# EAGLE schematic u1200 (EAGLE 9.6.2)

## Sheet 1 of 13: TITLE
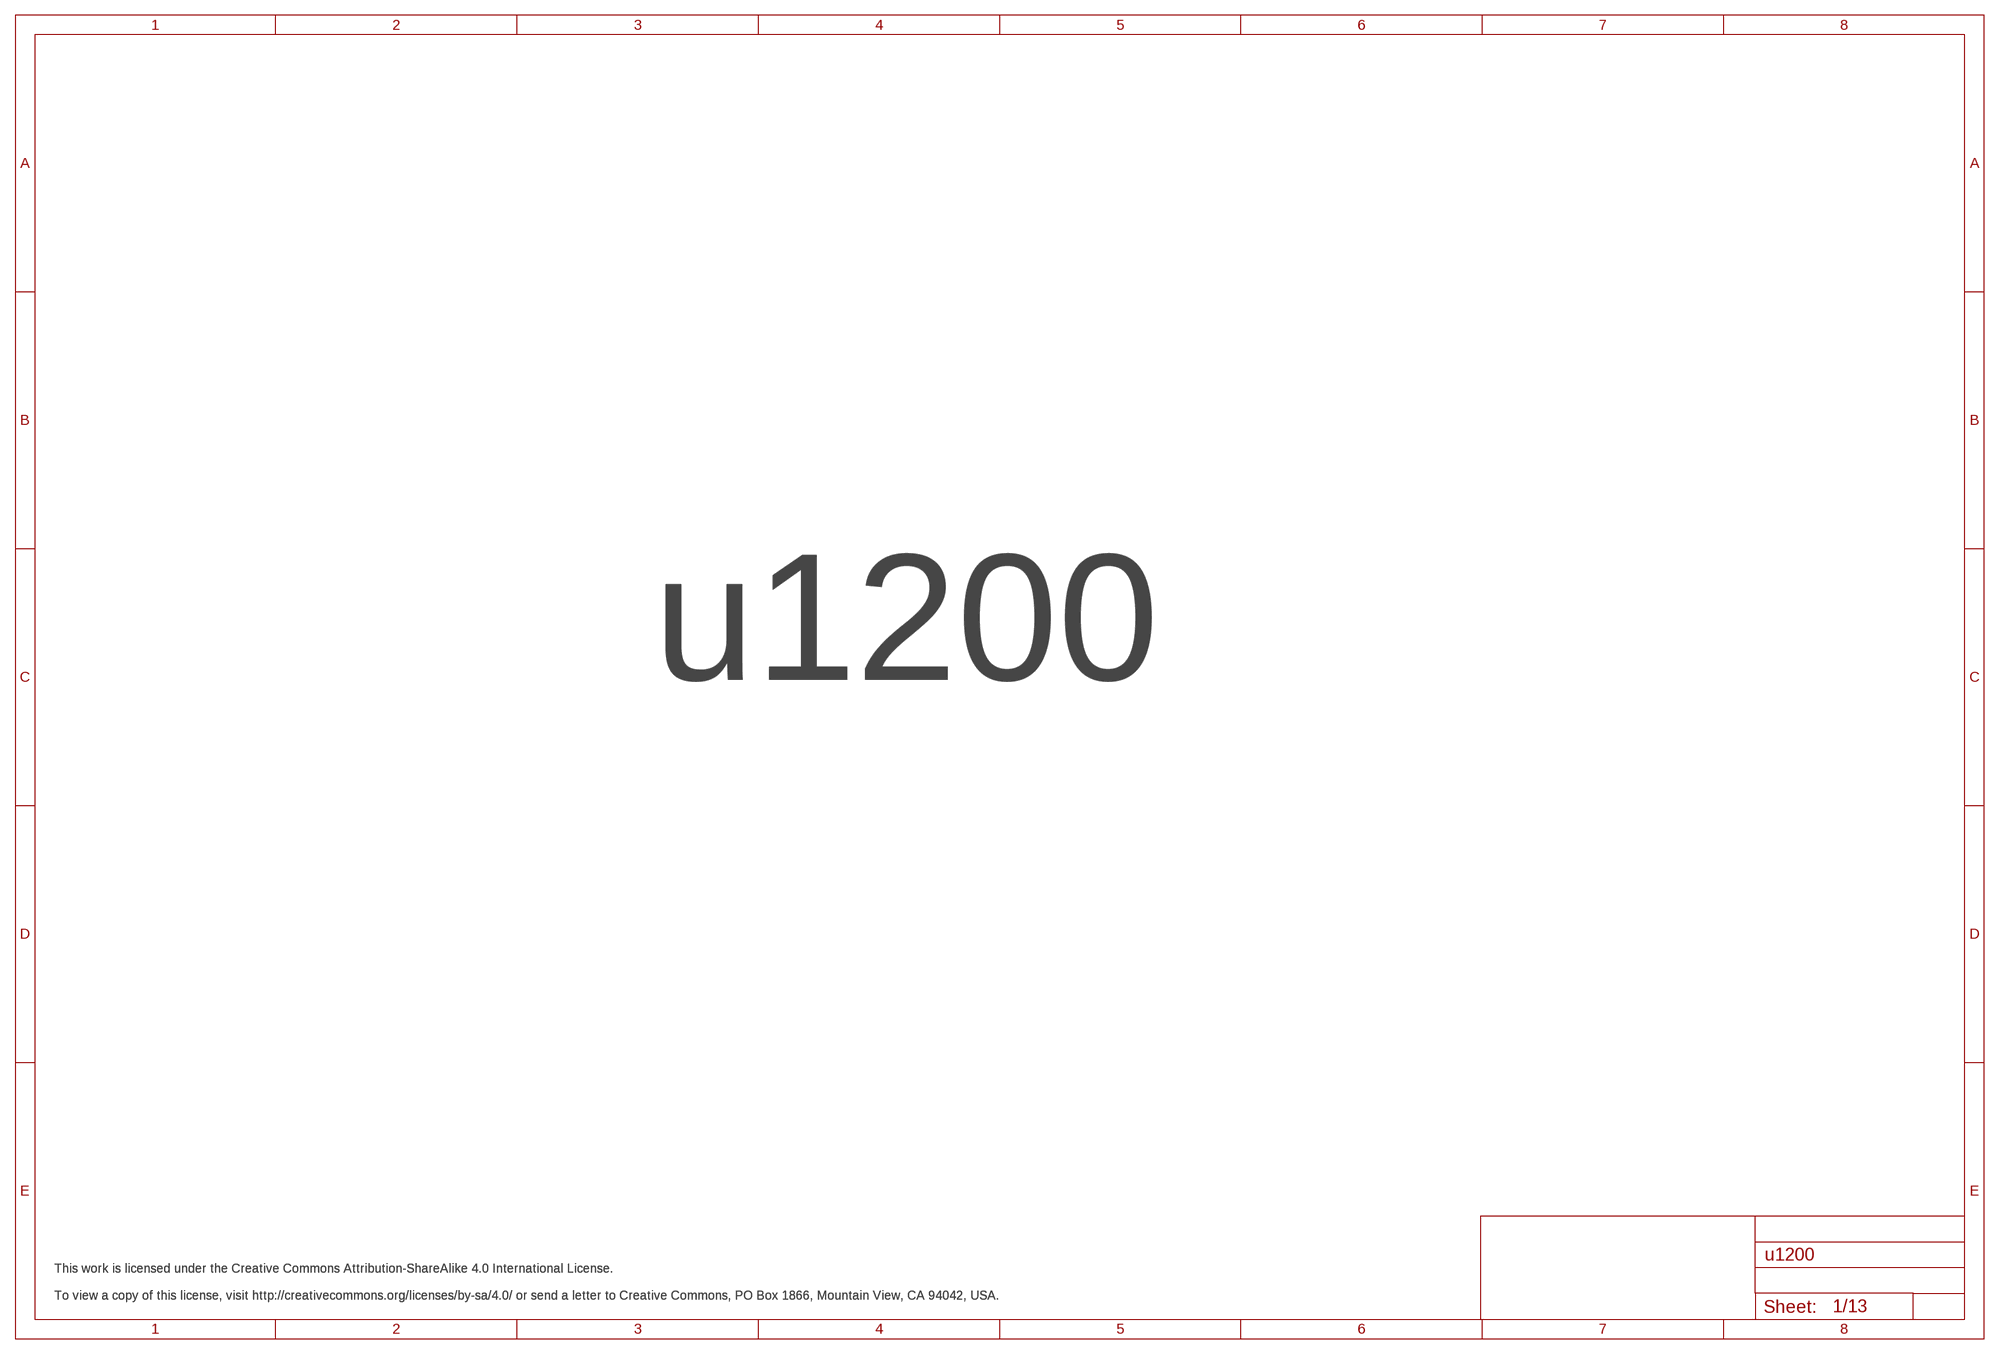
[diagram p0: schematic, sheet 1]

### Notes on the sheet
- u1200
- This work is licensed under the Creative Commons Attribution-ShareAlike 4.0 International License.
  
  To view a copy of this license, visit http://creativecommons.org/licenses/by-sa/4.0/ or send a letter to Creative Commons, PO Box 1866, Mountain View, CA 94042, USA.
- This work is licensed under the Creative Commons Attribution-ShareAlike 4.0 International License.
  
  To view a copy of this license, visit http://creativecommons.org/licenses/by-sa/4.0/ or send a letter to Creative Commons, PO Box 1866, Mountain View, CA 94042, USA.
- This work is licensed under the Creative Commons Attribution-ShareAlike 4.0 International License.
  
  To view a copy of this license, visit http://creativecommons.org/licenses/by-sa/4.0/ or send a letter to Creative Commons, PO Box 1866, Mountain View, CA 94042, USA.

## Sheet 2 of 13: EDGE CONNECTOR
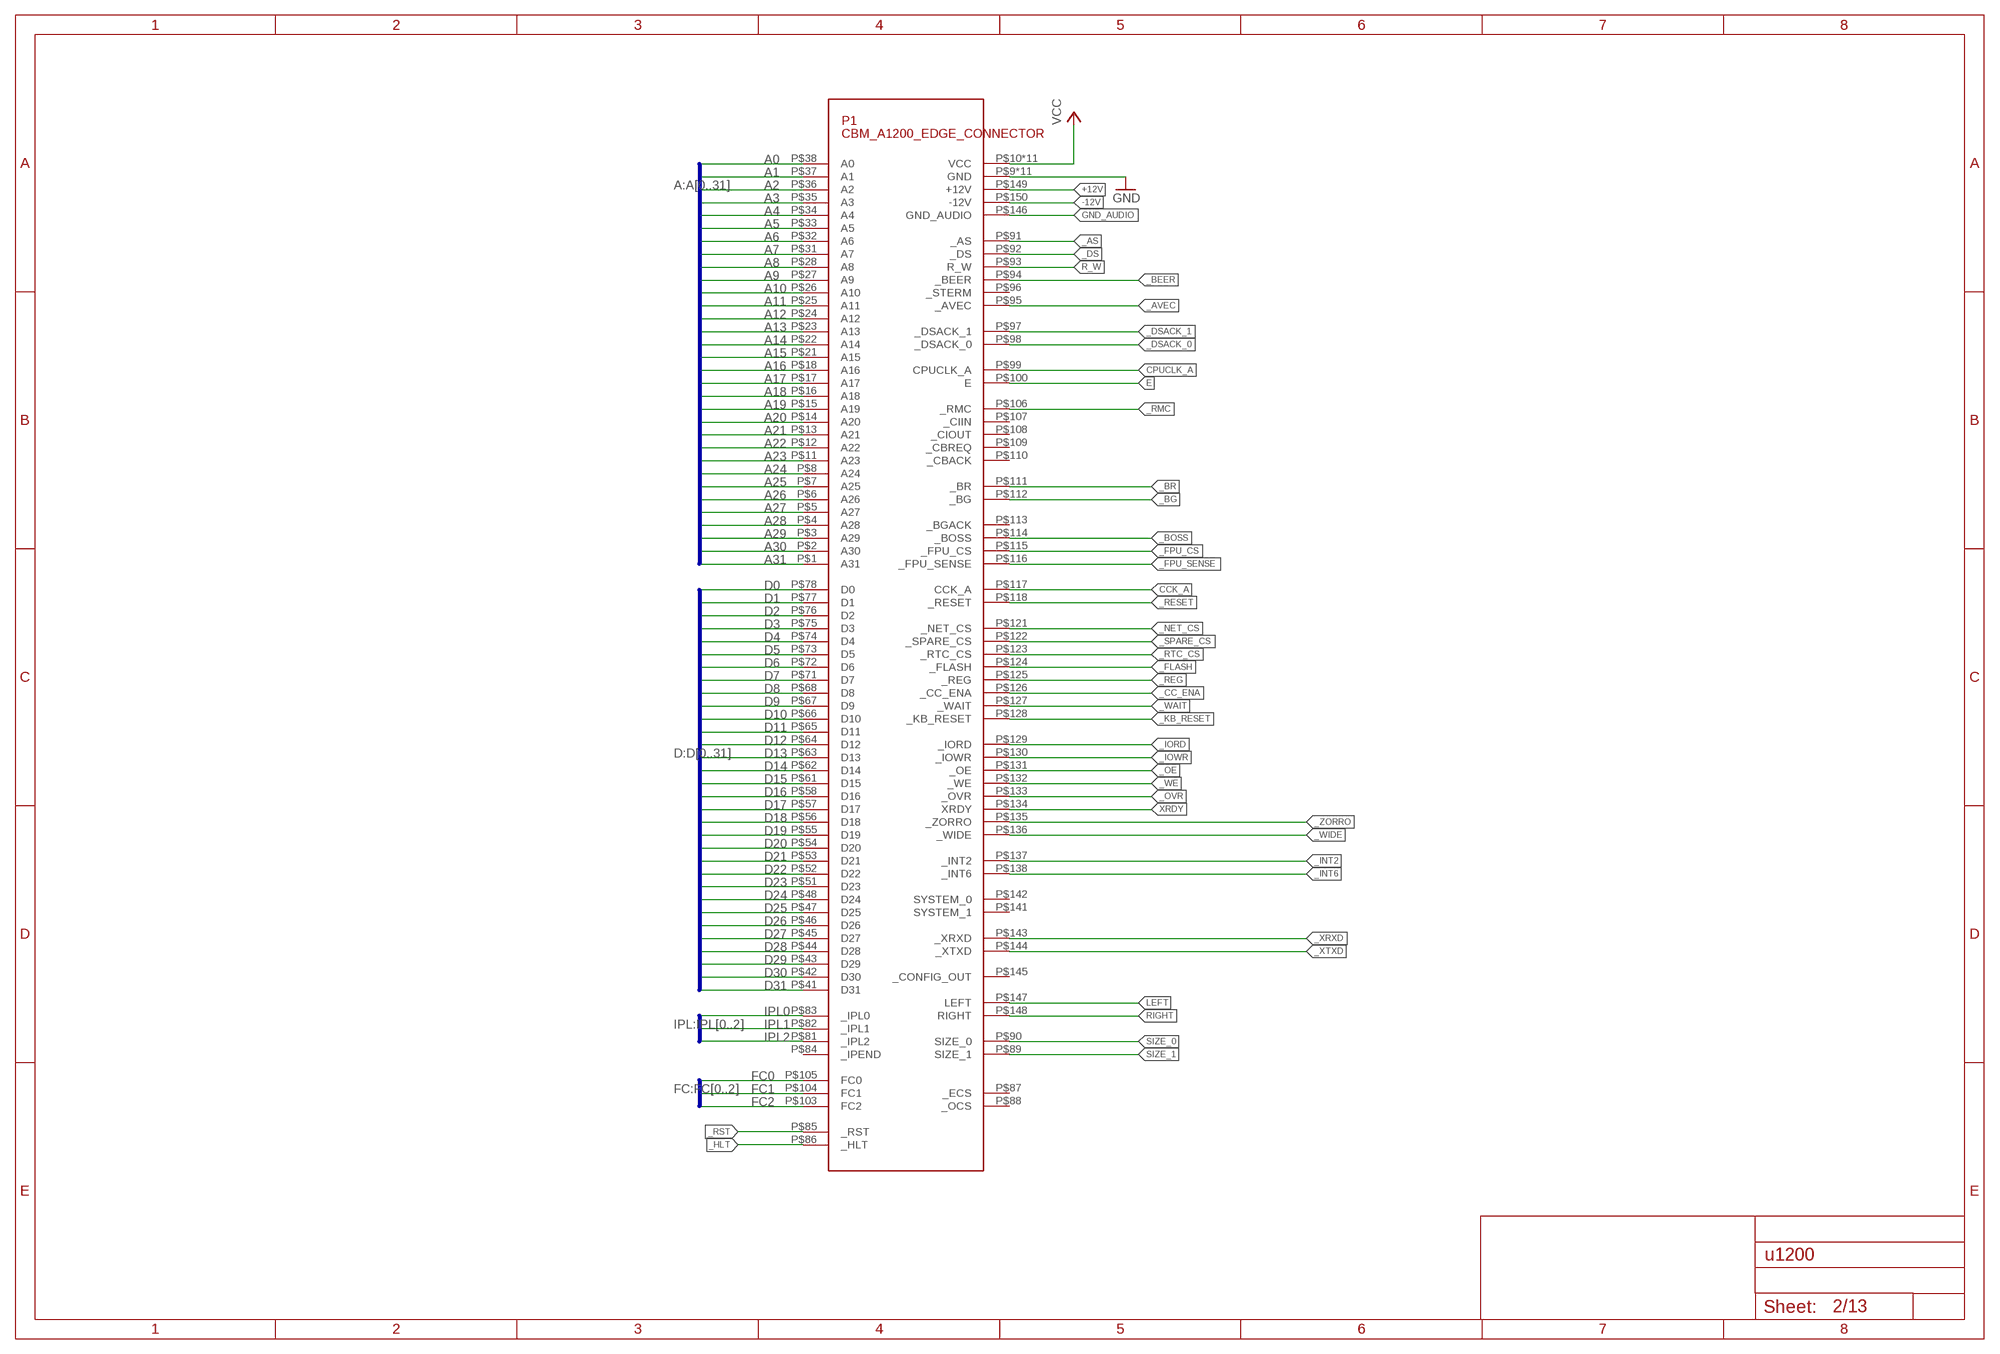
[diagram p1: schematic, sheet 2]

### Parts
P1  CBM_A1200_EDGE_CONNECTOR  [CBM_A1200_EDGE_CONNECTOR_150P]

### Nets
+12V [+12V]: P1.P$149(+12V) ; also sheet 4,13
-12V [-12V]: P1.P$150(-12V) ; also sheet 4,13
_AS: P1.P$91(_AS) ; also sheet 6
_AVEC: P1.P$95(_AVEC) ; also sheet 6
_BEER: P1.P$94(_BEER) ; also sheet 6
_BG: P1.P$112(_BG)
_BOSS: P1.P$114(_BOSS)
_BR: P1.P$111(_BR) ; also sheet 6
_CC_ENA: P1.P$126(_CC_ENA)
_DS: P1.P$92(_DS) ; also sheet 6,8
_DSACK_0: P1.P$98(_DSACK_0) ; also sheet 6
_DSACK_1: P1.P$97(_DSACK_1) ; also sheet 6
_FLASH: P1.P$124(_FLASH)
_FPU_CS: P1.P$115(_FPU_CS)
_FPU_SENSE: P1.P$116(_FPU_SENSE)
_HLT: P1.P$86(_HLT) ; also sheet 6
_INT2: P1.P$137(_INT2) ; also sheet 6
_INT6: P1.P$138(_INT6) ; also sheet 6
_IORD: P1.P$129(_IORD)
_IOWR: P1.P$130(_IOWR)
_KB_RESET: P1.P$128(_KB_RESET)
_NET_CS: P1.P$121(_NET_CS)
_OE: P1.P$131(_OE) ; also sheet 11
_OVR: P1.P$133(_OVR) ; also sheet 6
_REG: P1.P$125(_REG)
_RESET: P1.P$118(_RESET)
_RMC: P1.P$106(_RMC)
_RST: P1.P$85(_RST) ; also sheet 6,7,8,12
_RTC_CS: P1.P$123(_RTC_CS)
_SPARE_CS: P1.P$122(_SPARE_CS)
_WAIT: P1.P$127(_WAIT)
_WE: P1.P$132(_WE) ; also sheet 7
_WIDE: P1.P$136(_WIDE) ; also sheet 6,11
_XRXD: P1.P$143(_XRXD)
_XTXD: P1.P$144(_XTXD)
_ZORRO: P1.P$135(_ZORRO) ; also sheet 6
A0: P1.P$38(A0) ; also sheet 8
A1: P1.P$37(A1) ; also sheet 7,8
A2: P1.P$36(A2) ; also sheet 7,11
A3: P1.P$35(A3) ; also sheet 7,11
A4: P1.P$34(A4) ; also sheet 7,11
A5: P1.P$33(A5) ; also sheet 7,11
A6: P1.P$32(A6) ; also sheet 7,11
A7: P1.P$31(A7) ; also sheet 7,11
A8: P1.P$28(A8) ; also sheet 7,11
A9: P1.P$27(A9) ; also sheet 7,11
A10: P1.P$26(A10) ; also sheet 7,11
A11: P1.P$25(A11) ; also sheet 7,11
A12: P1.P$24(A12) ; also sheet 7,11
A13: P1.P$23(A13) ; also sheet 7,11
A14: P1.P$22(A14) ; also sheet 7,11
A15: P1.P$21(A15) ; also sheet 7,11
A16: P1.P$18(A16) ; also sheet 7,11
A17: P1.P$17(A17) ; also sheet 7,11
A18: P1.P$16(A18) ; also sheet 7,11
A19: P1.P$15(A19) ; also sheet 7
A20: P1.P$14(A20) ; also sheet 7
A21: P1.P$13(A21)
A22: P1.P$12(A22)
A23: P1.P$11(A23)
A24: P1.P$8(A24)
A25: P1.P$7(A25)
A26: P1.P$6(A26)
A27: P1.P$5(A27)
A28: P1.P$4(A28)
A29: P1.P$3(A29)
A30: P1.P$2(A30)
A31: P1.P$1(A31)
CCK_A: P1.P$117(CCK_A) ; also sheet 7
CPUCLK_A: P1.P$99(CPUCLK_A) ; also sheet 7
D0: P1.P$78(D0) ; also sheet 8,11
D1: P1.P$77(D1) ; also sheet 8,11
D2: P1.P$76(D2) ; also sheet 8,11
D3: P1.P$75(D3) ; also sheet 8,11
D4: P1.P$74(D4) ; also sheet 8,11
D5: P1.P$73(D5) ; also sheet 8,11
D6: P1.P$72(D6) ; also sheet 8,11
D7: P1.P$71(D7) ; also sheet 8,11
D8: P1.P$68(D8) ; also sheet 8,11
D9: P1.P$67(D9) ; also sheet 8,11
D10: P1.P$66(D10) ; also sheet 8,11
D11: P1.P$65(D11) ; also sheet 8,11
D12: P1.P$64(D12) ; also sheet 8,11
D13: P1.P$63(D13) ; also sheet 8,11
D14: P1.P$62(D14) ; also sheet 8,11
D15: P1.P$61(D15) ; also sheet 8,11
D16: P1.P$58(D16) ; also sheet 8,11
D17: P1.P$57(D17) ; also sheet 8,11
D18: P1.P$56(D18) ; also sheet 8,11
D19: P1.P$55(D19) ; also sheet 8,11
D20: P1.P$54(D20) ; also sheet 8,11
D21: P1.P$53(D21) ; also sheet 8,11
D22: P1.P$52(D22) ; also sheet 8,11
D23: P1.P$51(D23) ; also sheet 8,11
D24: P1.P$48(D24) ; also sheet 8,11
D25: P1.P$47(D25) ; also sheet 8,11
D26: P1.P$46(D26) ; also sheet 8,11
D27: P1.P$45(D27) ; also sheet 8,11
D28: P1.P$44(D28) ; also sheet 8,11
D29: P1.P$43(D29) ; also sheet 8,11
D30: P1.P$42(D30) ; also sheet 8,11
D31: P1.P$41(D31) ; also sheet 8,11
E: P1.P$100(E)
FC0: P1.P$105(FC0) ; also sheet 6
FC1: P1.P$104(FC1) ; also sheet 6
FC2: P1.P$103(FC2) ; also sheet 6
GND [GND]: P1.P$9(GND) P1.P$19(GND) P1.P$29(GND) P1.P$39(GND) P1.P$49(GND) P1.P$59(GND) P1.P$69(GND) P1.P$79(GND) P1.P$101(GND) P1.P$119(GND) P1.P$139(GND) ; also sheet 4,5,7,8,11,12,13
GND_AUDIO [GND_AUDIO]: P1.P$146(GND_AUDIO)
IPL0: P1.P$83(_IPL0) ; also sheet 6
IPL1: P1.P$82(_IPL1) ; also sheet 6
IPL2: P1.P$81(_IPL2) ; also sheet 6
LEFT: P1.P$147(LEFT)
R_W: P1.P$93(R_W) ; also sheet 6,7,8
RIGHT: P1.P$148(RIGHT)
SIZE_0: P1.P$90(SIZE_0) ; also sheet 6,8
SIZE_1: P1.P$89(SIZE_1) ; also sheet 6,8
VCC [VCC]: P1.P$10(VCC) P1.P$20(VCC) P1.P$30(VCC) P1.P$40(VCC) P1.P$50(VCC) P1.P$60(VCC) P1.P$70(VCC) P1.P$80(VCC) P1.P$102(VCC) P1.P$120(VCC) P1.P$140(VCC) ; also sheet 4,6,7,11,13
XRDY: P1.P$134(XRDY) ; also sheet 6
Unconnected: P1.P$84(_IPEND) P1.P$87(_ECS) P1.P$88(_OCS) P1.P$96(_STERM) P1.P$107(_CIIN) P1.P$108(_CIOUT) P1.P$109(_CBREQ) P1.P$110(_CBACK) P1.P$113(_BGACK) P1.P$141(SYSTEM_1) P1.P$142(SYSTEM_0) P1.P$145(_CONFIG_OUT)

### Buses
A:A[0..31]
D:D[0..31]
IPL:IPL[0..2]
FC:FC[0..2]

## Sheet 3 of 13: MOUNT/GND/TEST
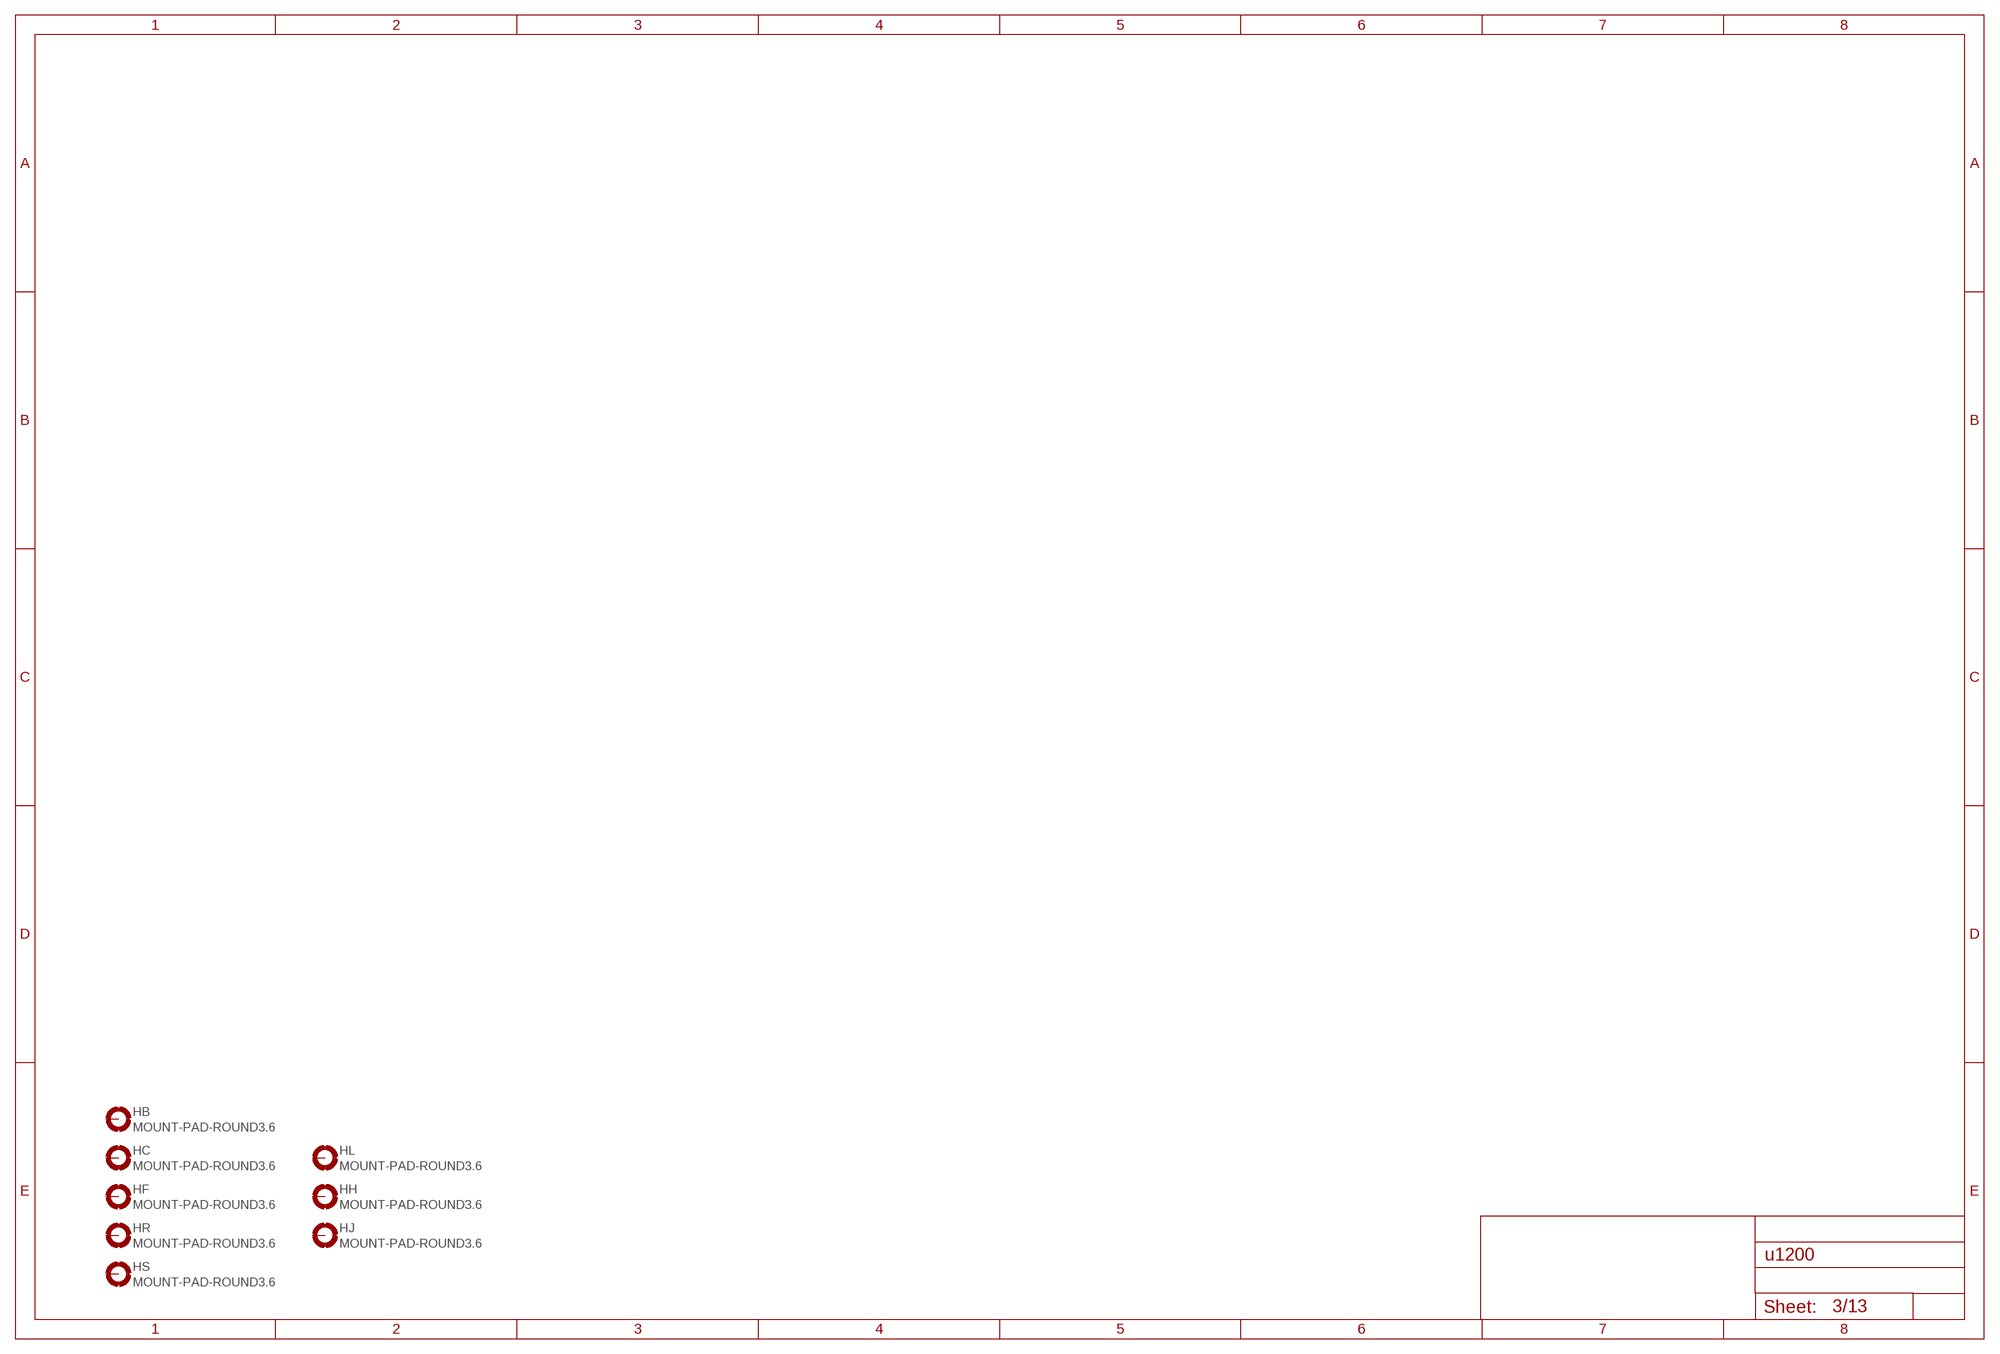
[diagram p2: schematic, sheet 3]

### Parts
HB  MOUNT-PAD-ROUND3.6  [3,6-PAD]
HC  MOUNT-PAD-ROUND3.6  [3,6-PAD]
HF  MOUNT-PAD-ROUND3.6  [3,6-PAD]
HH  MOUNT-PAD-ROUND3.6  [3,6-PAD]
HJ  MOUNT-PAD-ROUND3.6  [3,6-PAD]
HL  MOUNT-PAD-ROUND3.6  [3,6-PAD]
HR  MOUNT-PAD-ROUND3.6  [3,6-PAD]
HS  MOUNT-PAD-ROUND3.6  [3,6-PAD]
Unconnected: HB.B3,6(MOUNT) HC.B3,6(MOUNT) HF.B3,6(MOUNT) HH.B3,6(MOUNT) HJ.B3,6(MOUNT) HL.B3,6(MOUNT) HR.B3,6(MOUNT) HS.B3,6(MOUNT)

## Sheet 4 of 13: PWR/CHASIS
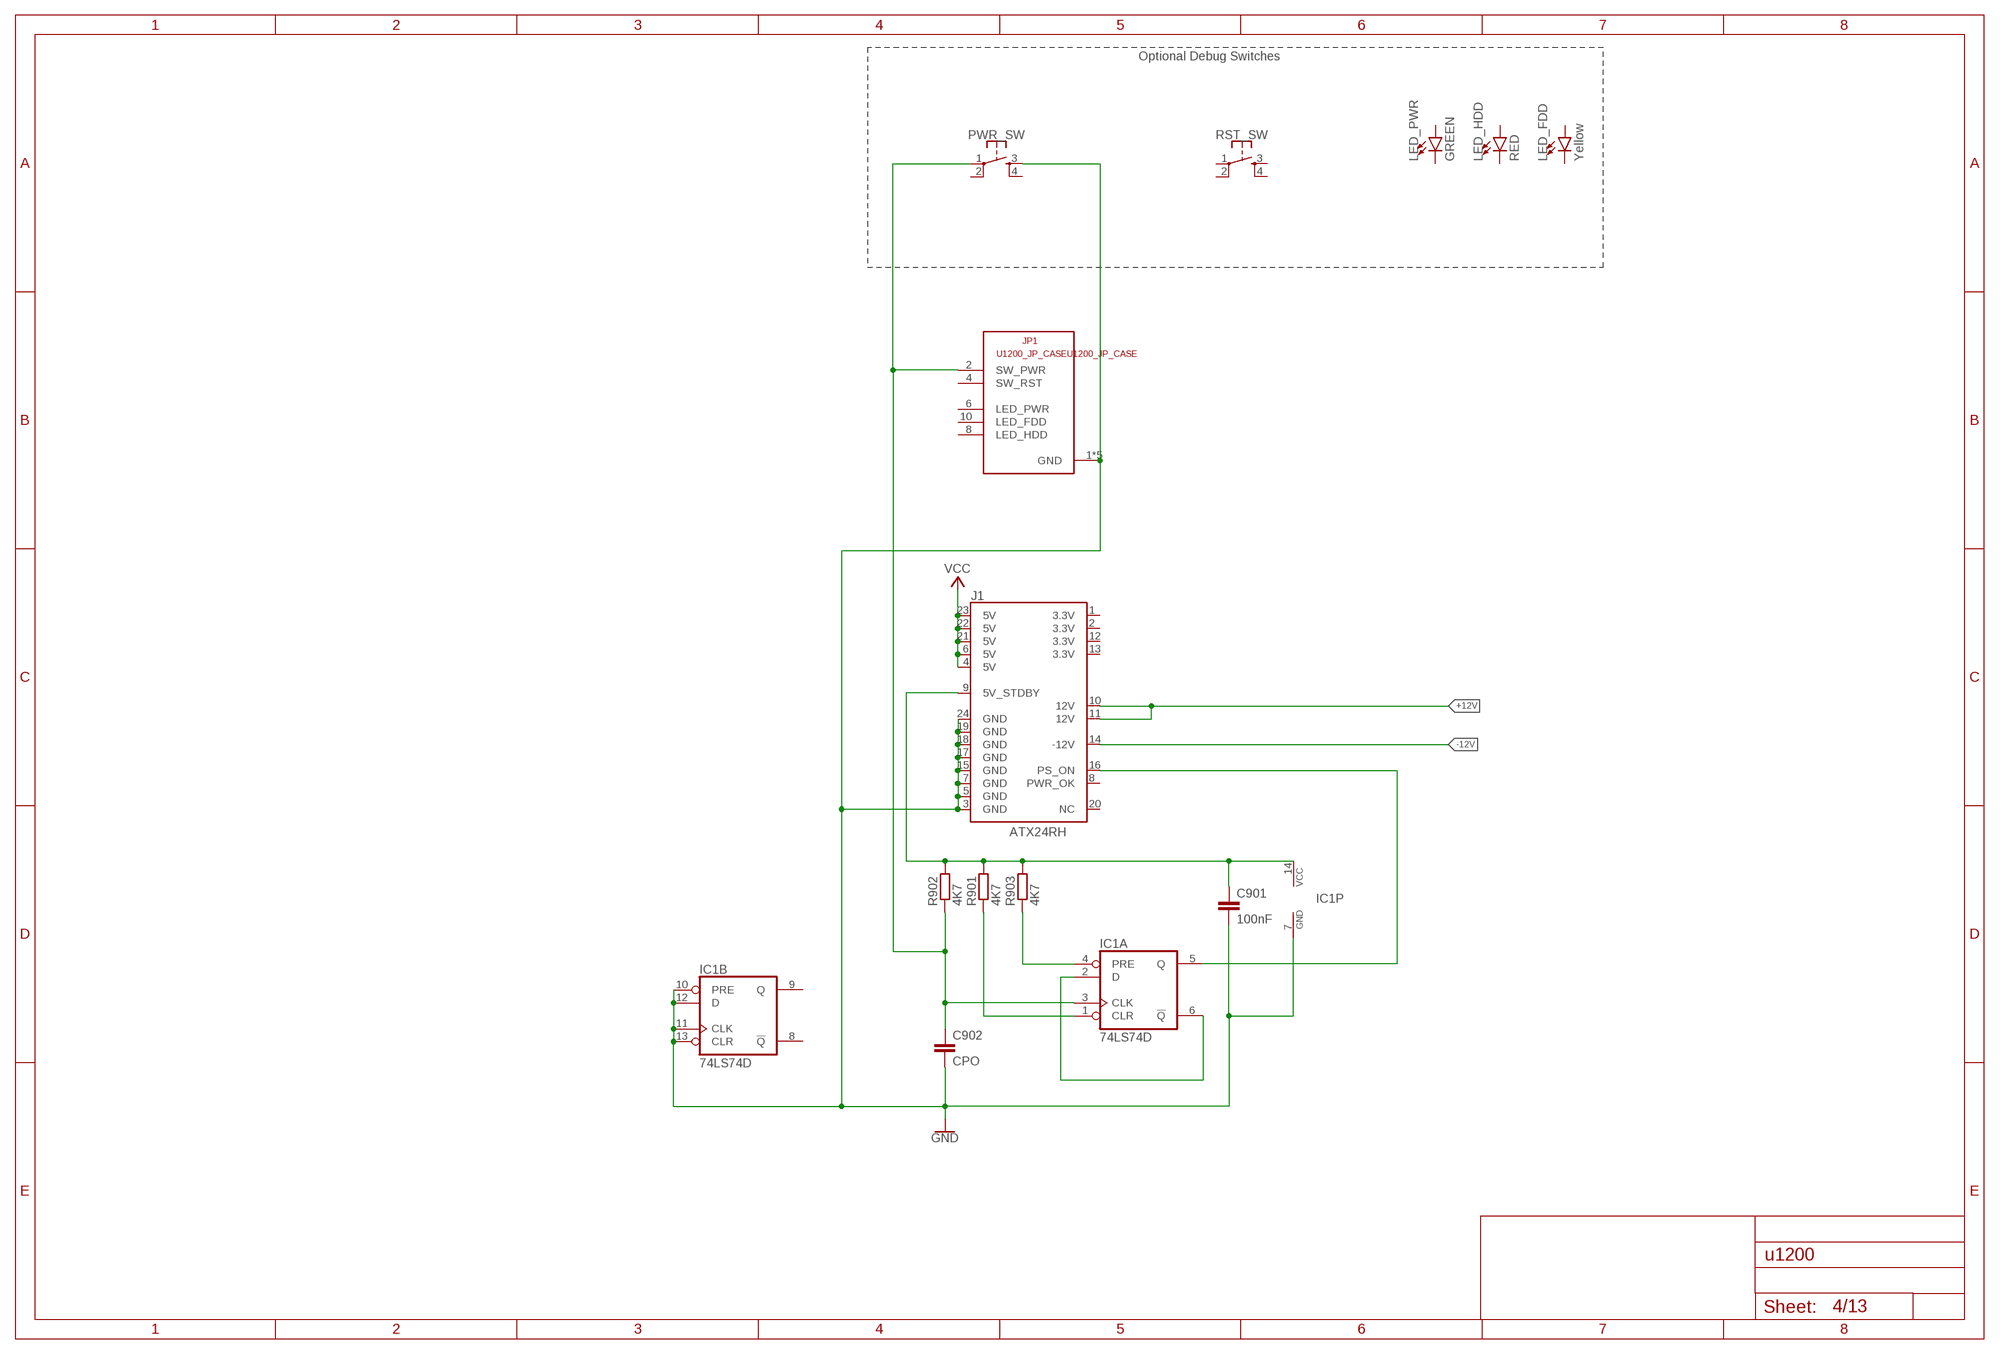
[diagram p3: schematic, sheet 4]

### Parts
C901  100nF  C-EUC0805  [C0805]
C902  CPO  C-EUC0805  [C0805]
IC1  74LS74D  [SO14]
J1  ATX24RH  [ATX24_RIGHT_ANGLE]
JP1  U1200_JP_CASEU1200_JP_CASE  [U1200_PINHEAD_2X05_ANNOTATED]
LED_FDD  Yellow  LED-YELLOW0603  [LED-0603]
LED_HDD  RED  LED-RED0603  [LED-0603]
LED_PWR  GREEN  LED-GREEN0603  [LED-0603]
PWR_SW  MOMENTARY-SWITCH-SPST-2-SMD-4.6X2.8MM  [TACTILE_SWITCH_SMD_4.6X2.8MM]
R901  4K7  R-EU_R0805  [R0805]
R902  4K7  R-EU_R0805  [R0805]
R903  4K7  R-EU_R0805  [R0805]
RST_SW  MOMENTARY-SWITCH-SPST-2-SMD-4.6X2.8MM  [TACTILE_SWITCH_SMD_4.6X2.8MM]

### Nets
+12V [+12V]: J1.10(12V) J1.11(12V) ; also sheet 2,13
-12V [-12V]: J1.14(-12V) ; also sheet 2,13
GND [GND]: C901.2 C902.2 IC1.7(P:GND) IC1.10(B:PRE) IC1.11(B:CLK) IC1.12(B:D) IC1.13(B:CLR) J1.3(GND) J1.5(GND) J1.7(GND) J1.15(GND) J1.17(GND) J1.18(GND) J1.19(GND) J1.24(GND) JP1.1(GND) JP1.3(GND) JP1.5(GND) JP1.7(GND) JP1.9(GND) PWR_SW.3 ; also sheet 2,5,7,8,11,12,13
N$1: C901.1 IC1.14(P:VCC) J1.9(5V_STDBY) R901.2 R902.2 R903.2
N$2: IC1.5(A:Q) J1.16(PS_ON)
N$3: IC1.4(A:PRE) R903.1
N$4: IC1.2(A:D) IC1.6(A:!Q)
N$6: IC1.1(A:CLR) R901.1
N$8: C902.1 IC1.3(A:CLK) JP1.2(SW_PWR) PWR_SW.1 R902.1
VCC [VCC]: J1.4(5V) J1.6(5V) J1.21(5V) J1.22(5V) J1.23(5V) ; also sheet 2,6,7,11,13
Unconnected: IC1.8(B:!Q) IC1.9(B:Q) J1.1(3.3V) J1.2(3.3V) J1.8(PWR_OK) J1.12(3.3V) J1.13(3.3V) J1.20(NC) JP1.4(SW_RST) JP1.6(LED_PWR) JP1.8(LED_HDD) JP1.10(LED_FDD) LED_FDD.A LED_FDD.C LED_HDD.A LED_HDD.C LED_PWR.A LED_PWR.C PWR_SW.2 PWR_SW.4 RST_SW.1 RST_SW.2 RST_SW.3 RST_SW.4

### Notes on the sheet
- Optional Debug Switches

## Sheet 5 of 13: GENERAL DECOUPLING
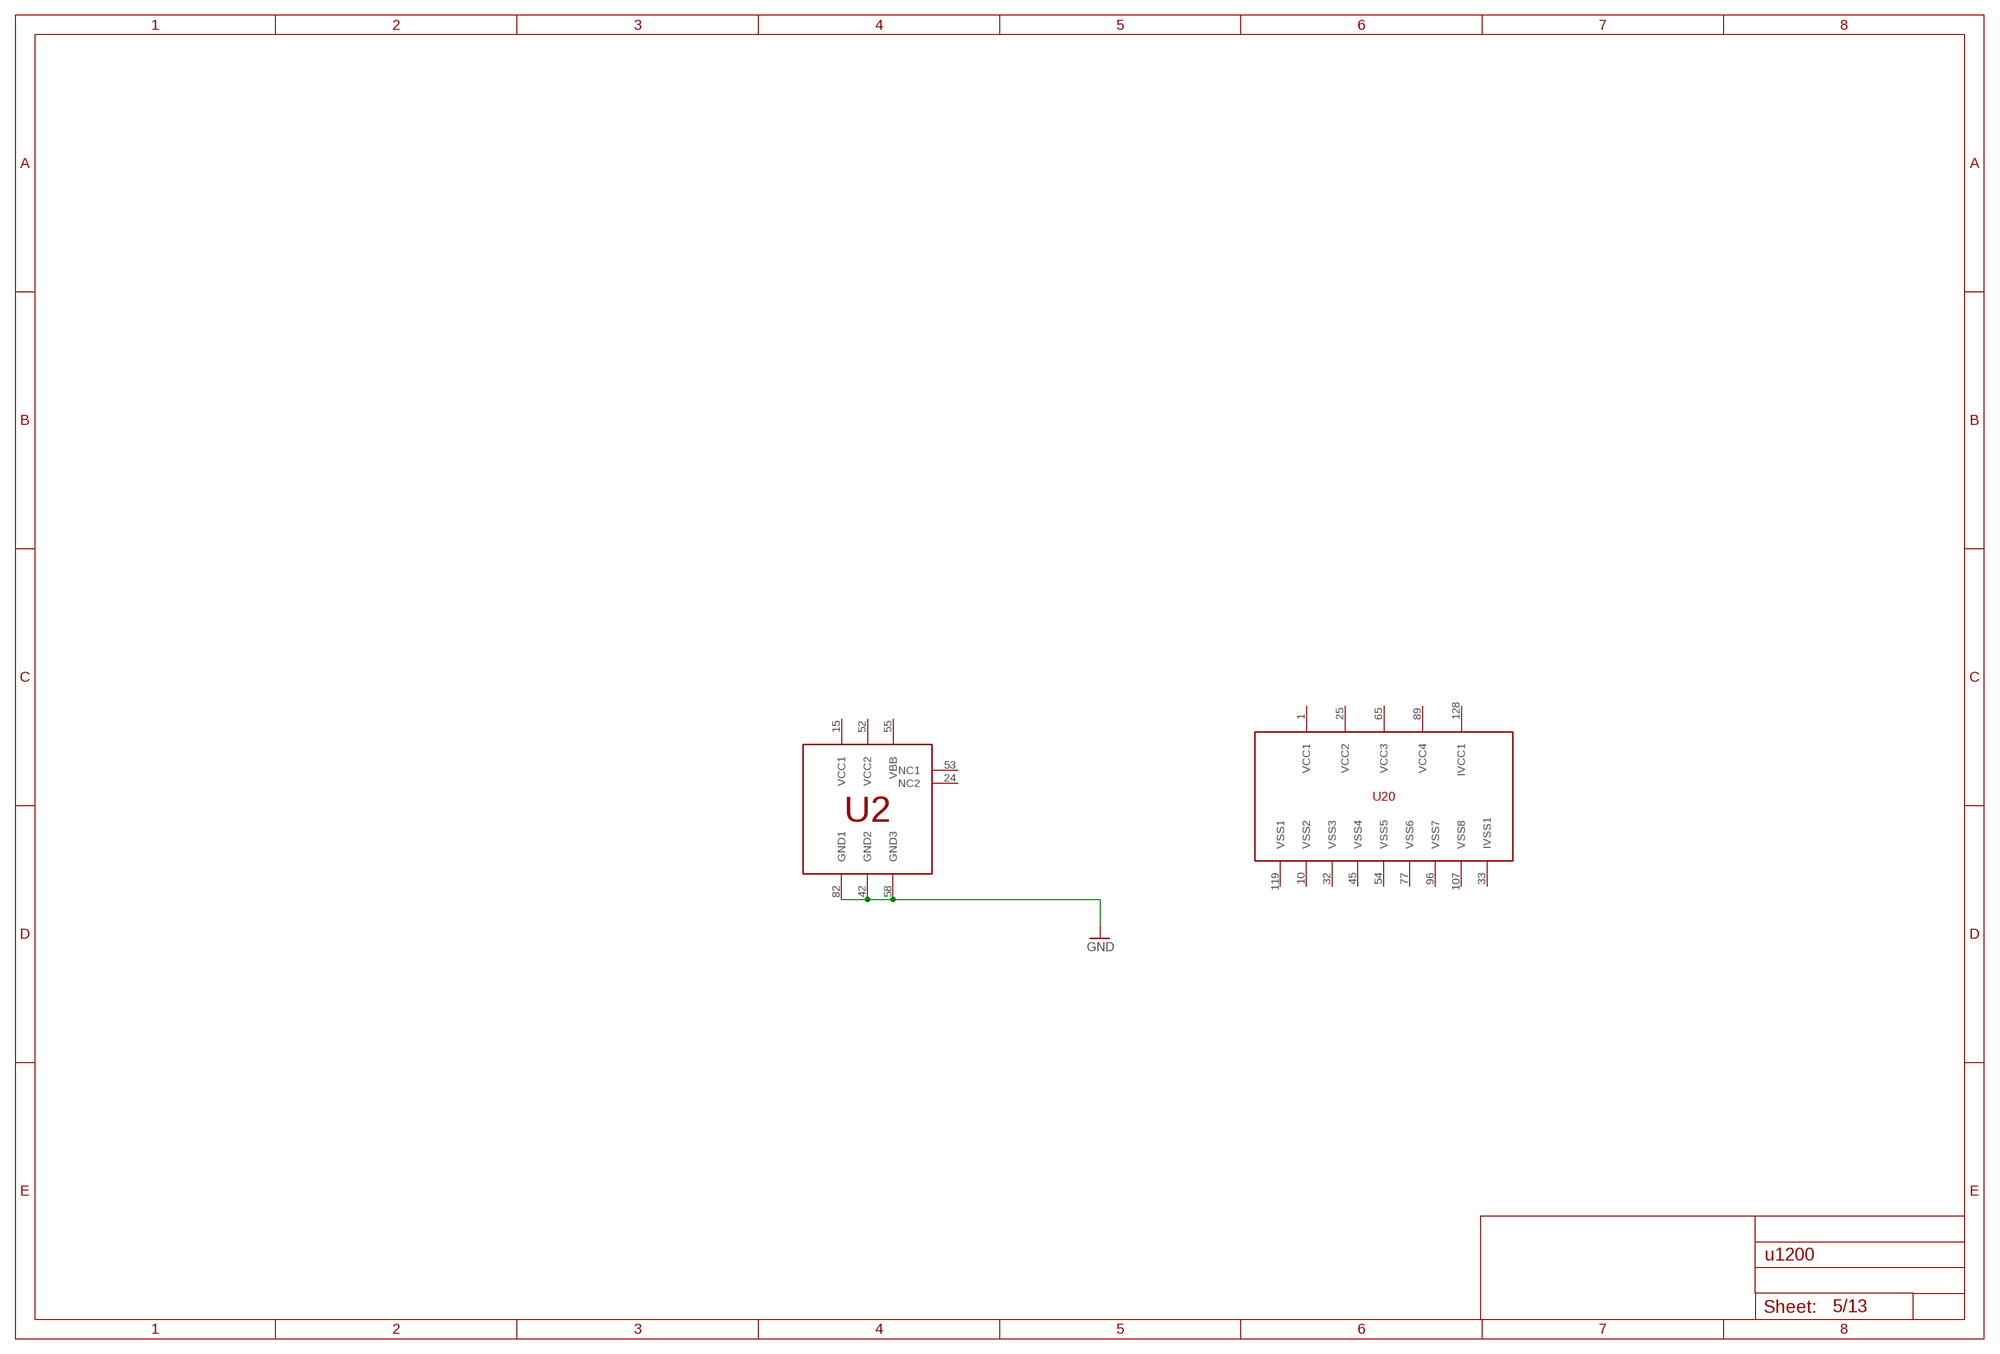
[diagram p4: schematic, sheet 5]

### Parts
U2  CBM_8374  [PLCC84-SMD-AMP-SOCKED]
U20  CBM_391425  [SQFP-S-28X28-128]

### Nets
GND [GND]: U2.42(GND2) U2.58(GND3) U2.82(GND1) ; also sheet 2,4,7,8,11,12,13
Unconnected: U2.24(NC2) U2.53(NC1) U20.1(VCC1) U20.10(VSS2) U20.25(VCC2) U20.32(VSS3) U20.33(IVSS1) U20.45(VSS4) U20.54(VSS5) U20.65(VCC3) U20.77(VSS6) U20.89(VCC4) U20.96(VSS7) U20.107(VSS8) U20.119(VSS1) U20.128(IVCC1)

## Sheet 6 of 13: TERMINATION
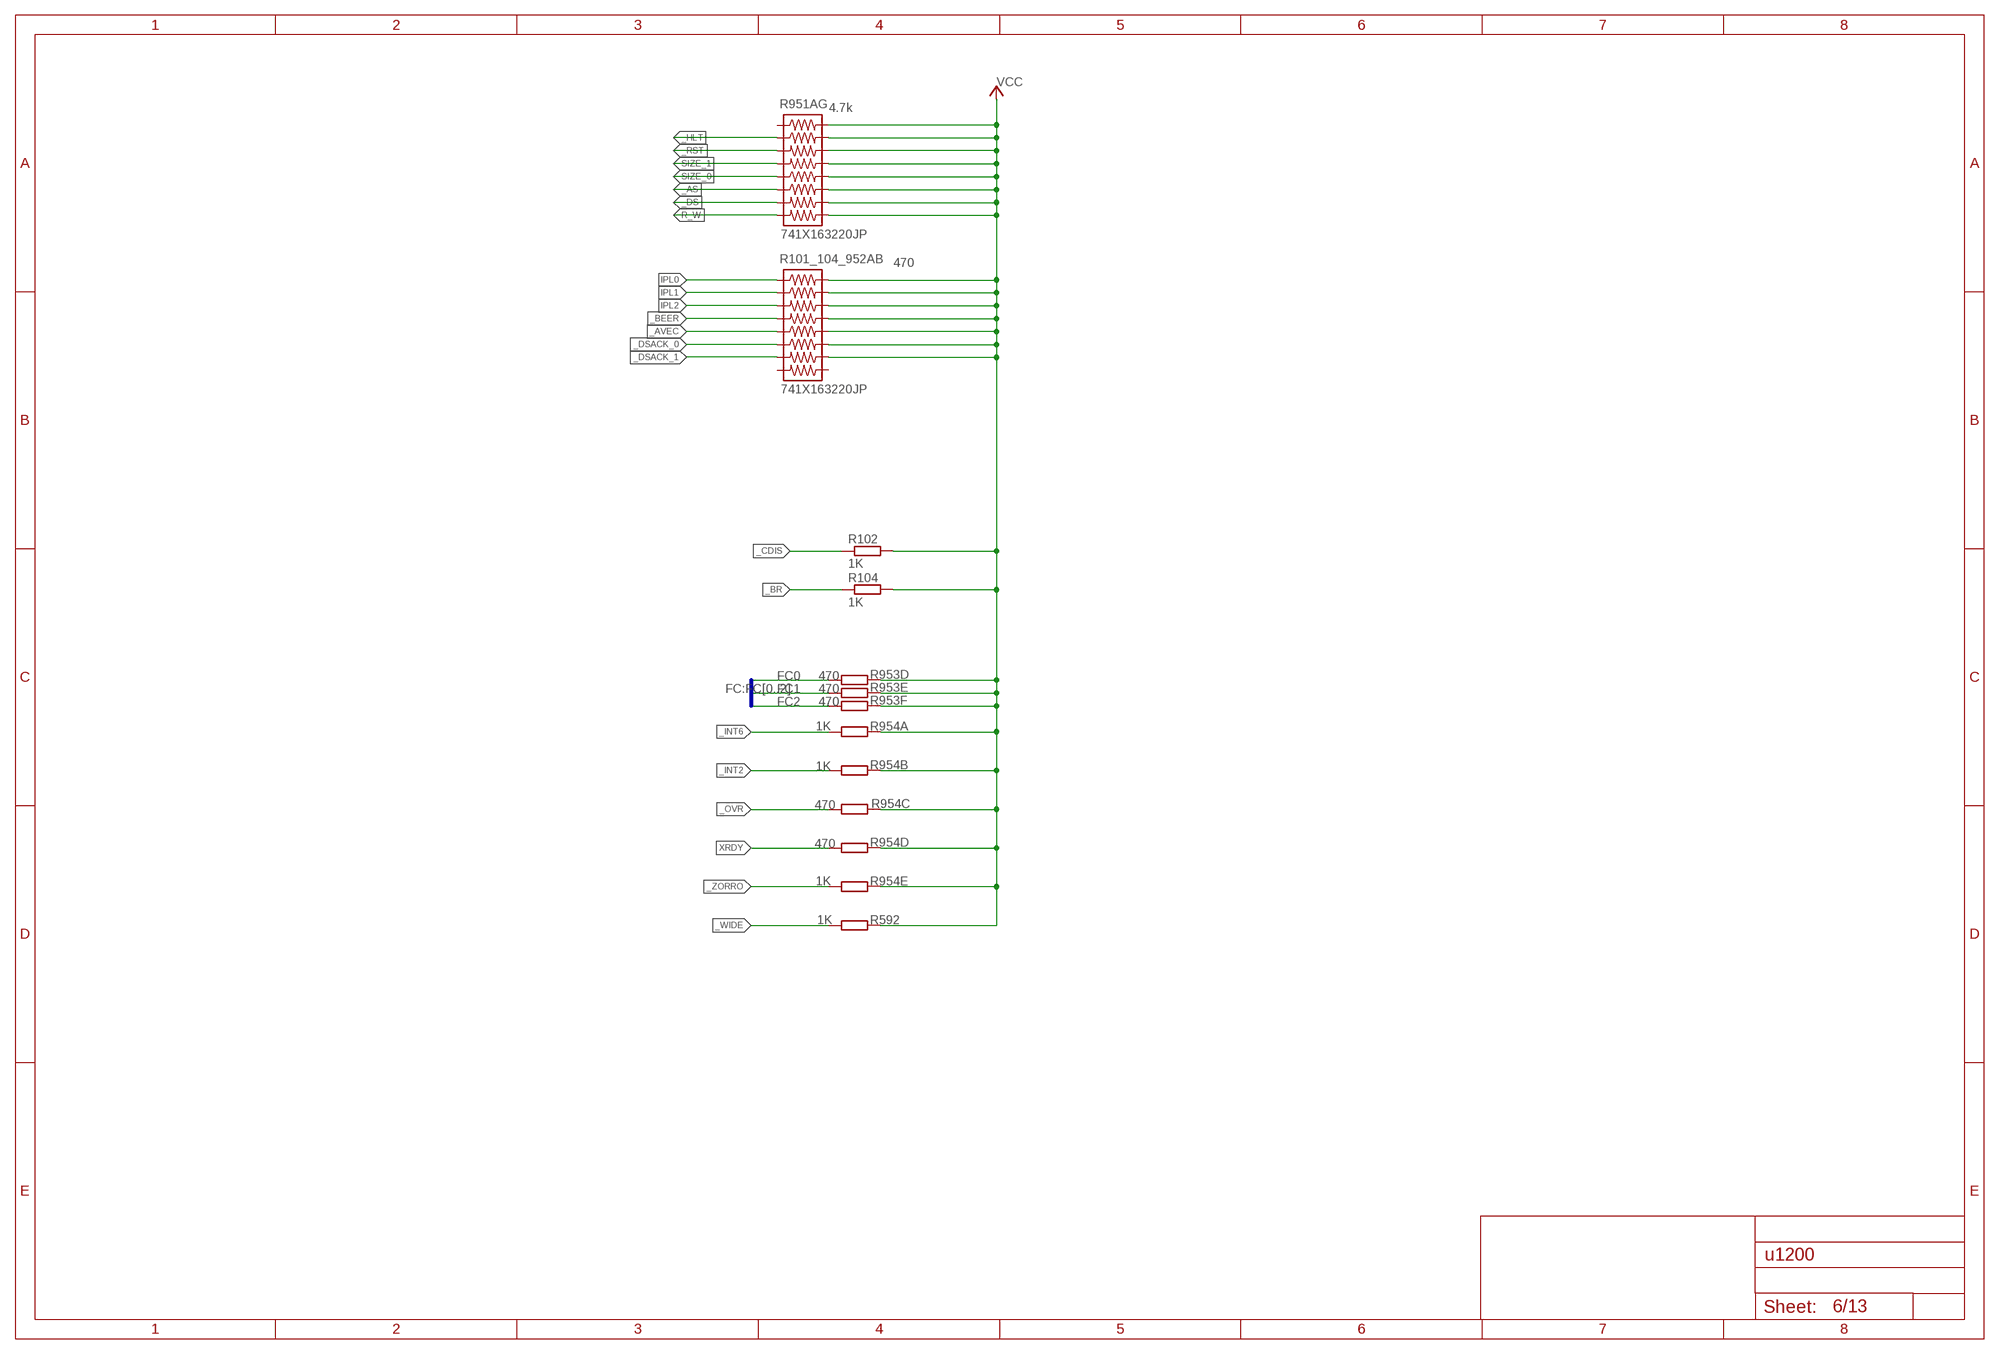
[diagram p5: schematic, sheet 6]

### Parts
R101_104_952AB  741X163220JP  [741X163220JP]
R102  1K  R-EU_R0805  [R0805]
R104  1K  R-EU_R0805  [R0805]
R592  1K  R-EU_R0805  [R0805]
R951AG  741X163220JP  [741X163220JP]
R953D  470  R-EU_R0805  [R0805]
R953E  470  R-EU_R0805  [R0805]
R953F  470  R-EU_R0805  [R0805]
R954A  1K  R-EU_R0805  [R0805]
R954B  1K  R-EU_R0805  [R0805]
R954C  470  R-EU_R0805  [R0805]
R954D  470  R-EU_R0805  [R0805]
R954E  1K  R-EU_R0805  [R0805]

### Nets
_AS: R951AG.6 ; also sheet 2
_AVEC: R101_104_952AB.5 ; also sheet 2
_BEER: R101_104_952AB.4 ; also sheet 2
_BR: R104.1 ; also sheet 2
_CDIS: R102.1
_DS: R951AG.7 ; also sheet 2,8
_DSACK_0: R101_104_952AB.6 ; also sheet 2
_DSACK_1: R101_104_952AB.7 ; also sheet 2
_HLT: R951AG.2 ; also sheet 2
_INT2: R954B.1 ; also sheet 2
_INT6: R954A.1 ; also sheet 2
_OVR: R954C.1 ; also sheet 2
_RST: R951AG.3 ; also sheet 2,7,8,12
_WIDE: R592.1 ; also sheet 2,11
_ZORRO: R954E.1 ; also sheet 2
FC0: R953D.1 ; also sheet 2
FC1: R953E.1 ; also sheet 2
FC2: R953F.1 ; also sheet 2
IPL0: R101_104_952AB.1 ; also sheet 2
IPL1: R101_104_952AB.2 ; also sheet 2
IPL2: R101_104_952AB.3 ; also sheet 2
R_W: R951AG.8 ; also sheet 2,7,8
SIZE_0: R951AG.5 ; also sheet 2,8
SIZE_1: R951AG.4 ; also sheet 2,8
VCC [VCC]: R101_104_952AB.10 R101_104_952AB.11 R101_104_952AB.12 R101_104_952AB.13 R101_104_952AB.14 R101_104_952AB.15 R101_104_952AB.16 R102.2 R104.2 R592.2 R951AG.9 R951AG.10 R951AG.11 R951AG.12 R951AG.13 R951AG.14 R951AG.15 R951AG.16 R953D.2 R953E.2 R953F.2 R954A.2 R954B.2 R954C.2 R954D.2 R954E.2 ; also sheet 2,4,7,11,13
XRDY: R954D.1 ; also sheet 2
Unconnected: R101_104_952AB.8 R101_104_952AB.9 R951AG.1

### Buses
FC:FC[0..2]

### Notes on the sheet
- 4.7k
- 470

## Sheet 7 of 13: U2 - CBM 8374 - ADDRESS/DMA/BUS
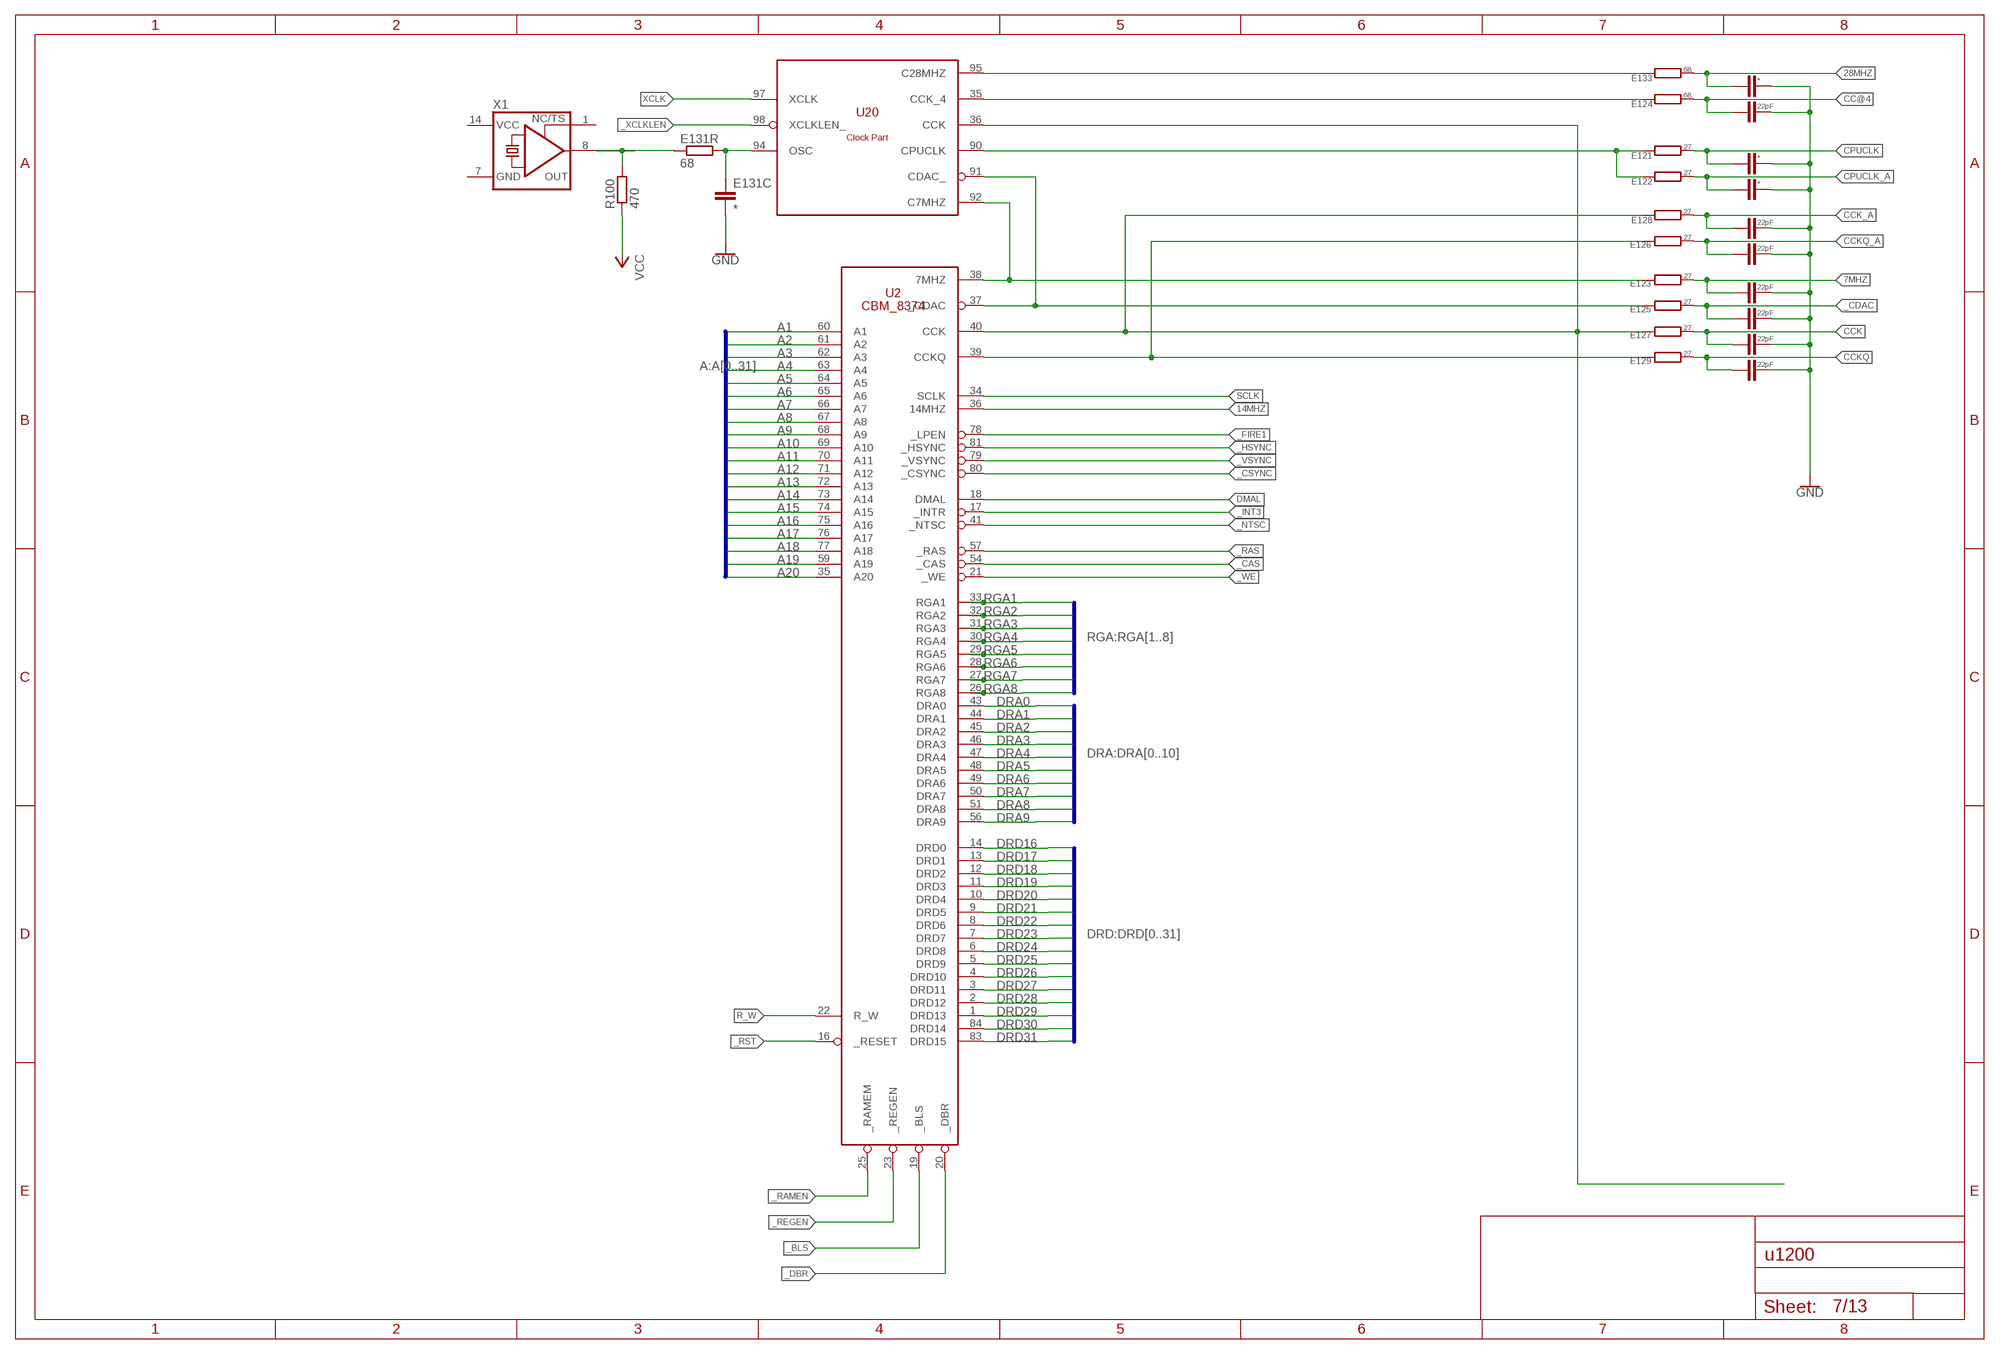
[diagram p6: schematic, sheet 7]

### Parts
E121C  *  C-EUC0805  [C0805]
E121R  27  R-EU_R0805  [R0805]
E122C  *  C-EUC0805  [C0805]
E122R  27  R-EU_R0805  [R0805]
E123C  22pF  C-EUC0805  [C0805]
E123R  27  R-EU_R0805  [R0805]
E124C  22pF  C-EUC0805  [C0805]
E124R  68  R-EU_R0805  [R0805]
E125C  22pF  C-EUC0805  [C0805]
E125R  27  R-EU_R0805  [R0805]
E126C  22pF  C-EUC0805  [C0805]
E126R  27  R-EU_R0805  [R0805]
E127C  22pF  C-EUC0805  [C0805]
E127R  27  R-EU_R0805  [R0805]
E128C  22pF  C-EUC0805  [C0805]
E128R  27  R-EU_R0805  [R0805]
E129C  22pF  C-EUC0805  [C0805]
E129R  27  R-EU_R0805  [R0805]
E131C  *  C-EUC0805  [C0805]
E131R  68  R-EU_R0805  [R0805]
E133C  *  C-EUC0805  [C0805]
E133R  68  R-EU_R0805  [R0805]
R100  470  R-EU_R0805  [R0805]
X1  XO-14  [DIL14S]

### Nets
7MHZ: E123C.1 E123R.1 E123R.2 U2.38(7MHZ) U20.92(C7MHZ)
14MHZ: U2.36(14MHZ) ; also sheet 12
28MHZ: E133C.1 E133R.2
_BLS: U2.19(_BLS)
_CAS: U2.54(_CAS) ; also sheet 8
_CDAC: E125C.1 E125R.1 E125R.2 U2.37(_CDAC) U20.91(CDAC_)
_CSYNC: U2.80(_CSYNC) ; also sheet 13
_DBR: U2.20(_DBR) ; also sheet 8
_FIRE1: U2.78(_LPEN)
_HSYNC: U2.81(_HSYNC) ; also sheet 13
_INT3: U2.17(_INTR)
_NTSC: U2.41(_NTSC)
_RAMEN: U2.25(_RAMEM)
_RAS: U2.57(_RAS) ; also sheet 8
_REGEN: U2.23(_REGEN)
_RST: U2.16(_RESET) ; also sheet 2,6,8,12
_VSYNC: U2.79(_VSYNC) ; also sheet 13
_WE: U2.21(_WE) ; also sheet 2
_XCLKLEN: U20.98(XCLKLEN_)
A1: U2.60(A1) ; also sheet 2,8
A2: U2.61(A2) ; also sheet 2,11
A3: U2.62(A3) ; also sheet 2,11
A4: U2.63(A4) ; also sheet 2,11
A5: U2.64(A5) ; also sheet 2,11
A6: U2.65(A6) ; also sheet 2,11
A7: U2.66(A7) ; also sheet 2,11
A8: U2.67(A8) ; also sheet 2,11
A9: U2.68(A9) ; also sheet 2,11
A10: U2.69(A10) ; also sheet 2,11
A11: U2.70(A11) ; also sheet 2,11
A12: U2.71(A12) ; also sheet 2,11
A13: U2.72(A13) ; also sheet 2,11
A14: U2.73(A14) ; also sheet 2,11
A15: U2.74(A15) ; also sheet 2,11
A16: U2.75(A16) ; also sheet 2,11
A17: U2.76(A17) ; also sheet 2,11
A18: U2.77(A18) ; also sheet 2,11
A19: U2.59(A19) ; also sheet 2
A20: U2.35(A20) ; also sheet 2
C28MHZ: E133R.1 U20.95(C28MHZ)
CC@4: E124C.1 E124R.2
CCK: E127C.1 E127R.1 E127R.2 E128R.1 U2.40(CCK) U20.36(CCK) ; also sheet 12
CCK_4: E124R.1 U20.35(CCK_4)
CCK_A: E128C.1 E128R.2 ; also sheet 2
CCKQ: E126R.1 E129C.1 E129R.1 E129R.2 U2.39(CCKQ)
CCKQ_A: E126C.1 E126R.2
CPUCLK: E121C.1 E121R.1 E121R.2 E122R.1 U20.90(CPUCLK)
CPUCLK_A: E122C.1 E122R.2 ; also sheet 2
DMAL: U2.18(DMAL)
DRA0: U2.43(DRA0) ; also sheet 8
DRA1: U2.44(DRA1) ; also sheet 8
DRA2: U2.45(DRA2) ; also sheet 8
DRA3: U2.46(DRA3) ; also sheet 8
DRA4: U2.47(DRA4) ; also sheet 8
DRA5: U2.48(DRA5) ; also sheet 8
DRA6: U2.49(DRA6) ; also sheet 8
DRA7: U2.50(DRA7) ; also sheet 8
DRA8: U2.51(DRA8) ; also sheet 8
DRA9: U2.56(DRA9)
DRD16: U2.14(DRD0) ; also sheet 8,12,13
DRD17: U2.13(DRD1) ; also sheet 8,12,13
DRD18: U2.12(DRD2) ; also sheet 8,12,13
DRD19: U2.11(DRD3) ; also sheet 8,12,13
DRD20: U2.10(DRD4) ; also sheet 8,12,13
DRD21: U2.9(DRD5) ; also sheet 8,12,13
DRD22: U2.8(DRD6) ; also sheet 8,12,13
DRD23: U2.7(DRD7) ; also sheet 8,12,13
DRD24: U2.6(DRD8) ; also sheet 8,12,13
DRD25: U2.5(DRD9) ; also sheet 8,12,13
DRD26: U2.4(DRD10) ; also sheet 8,12,13
DRD27: U2.3(DRD11) ; also sheet 8,12,13
DRD28: U2.2(DRD12) ; also sheet 8,12,13
DRD29: U2.1(DRD13) ; also sheet 8,12,13
DRD30: U2.84(DRD14) ; also sheet 8,12,13
DRD31: U2.83(DRD15) ; also sheet 8,12,13
GND [GND]: E121C.2 E122C.2 E123C.2 E124C.2 E125C.2 E126C.2 E127C.2 E128C.2 E129C.2 E131C.2 E133C.2 ; also sheet 2,4,5,8,11,12,13
N$5: E131R.1 R100.2 X1.8(OUT)
N$7: E131C.1 E131R.2 U20.94(OSC)
R_W: U2.22(R_W) ; also sheet 2,6,8
RGA1: U2.33(RGA1) ; also sheet 12,13
RGA2: U2.32(RGA2) ; also sheet 12,13
RGA3: U2.31(RGA3) ; also sheet 12,13
RGA4: U2.30(RGA4) ; also sheet 12,13
RGA5: U2.29(RGA5) ; also sheet 12,13
RGA6: U2.28(RGA6) ; also sheet 12,13
RGA7: U2.27(RGA7) ; also sheet 12,13
RGA8: U2.26(RGA8) ; also sheet 12,13
SCLK: U2.34(SCLK) ; also sheet 12
VCC [VCC]: R100.1 ; also sheet 2,4,6,11,13
XCLK: U20.97(XCLK)
Unconnected: X1.1(TS)

### Buses
A:A[0..31]
RGA:RGA[1..8]
DRA:DRA[0..10]
DRD:DRD[0..31]

### Notes on the sheet
- E133
- E124
- E121
- E122
- E128
- E126
- E123
- E125
- E127
- E129

## Sheet 8 of 13: U20 - DRAM CONTROLLER/DRAM
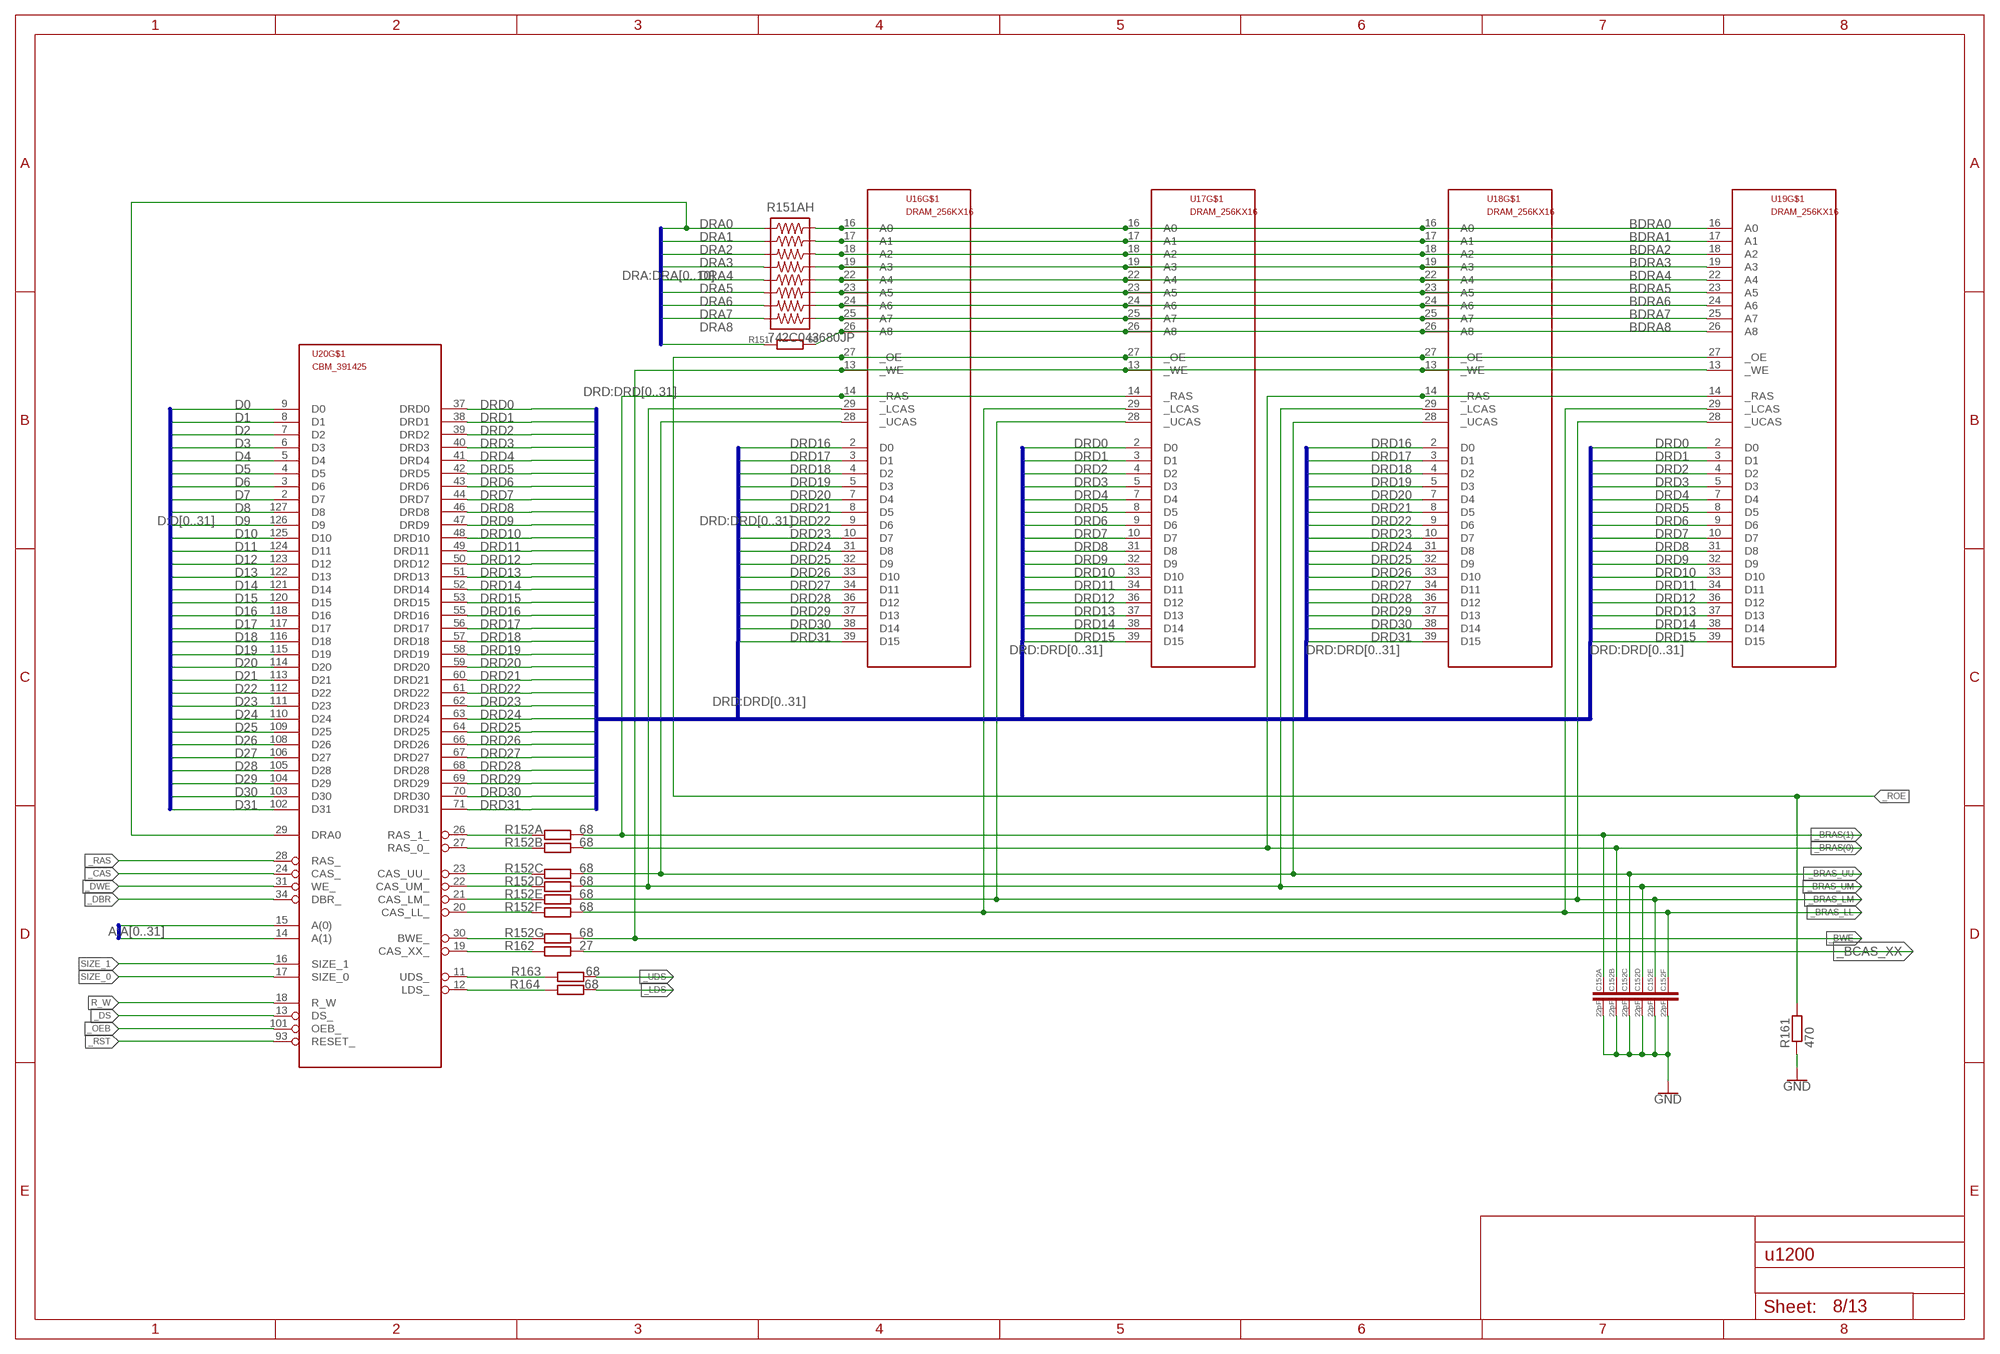
[diagram p7: schematic, sheet 8]

### Parts
C152A  22pF  C-EUC0805  [C0805]
C152B  22pF  C-EUC0805  [C0805]
C152C  22pF  C-EUC0805  [C0805]
C152D  22pF  C-EUC0805  [C0805]
C152E  22pF  C-EUC0805  [C0805]
C152F  22pF  C-EUC0805  [C0805]
R151AH  742C043680JP  742C163220JP  [742C163220JP]
R151I  68  R-EU_R0603  [R0603]
R152A  68  R-EU_R0805  [R0805]
R152B  68  R-EU_R0805  [R0805]
R152C  68  R-EU_R0805  [R0805]
R152D  68  R-EU_R0805  [R0805]
R152E  68  R-EU_R0805  [R0805]
R152F  68  R-EU_R0805  [R0805]
R152G  68  R-EU_R0805  [R0805]
R161  470  R-EU_R0805  [R0805]
R162  27  R-EU_R0805  [R0805]
R163  68  R-EU_R0805  [R0805]
R164  68  R-EU_R0805  [R0805]
U16  DRAM_256KX16  [SOJ127P1117X376-40]
U17  DRAM_256KX16  [SOJ127P1117X376-40]
U18  DRAM_256KX16  [SOJ127P1117X376-40]
U19  DRAM_256KX16  [SOJ127P1117X376-40]

### Nets
_BCAS_XX: R162.2 ; also sheet 12
_BRAS(0): C152B.1 R152B.2 U18.14(_RAS) U19.14(_RAS)
_BRAS(1): C152A.1 R152A.2 U16.14(_RAS) U17.14(_RAS)
_BRAS_LL: C152F.1 R152F.2 U17.29(_LCAS) U19.29(_LCAS)
_BRAS_LM: C152E.1 R152E.2 U17.28(_UCAS) U19.28(_UCAS)
_BRAS_UM: C152D.1 R152D.2 U16.29(_LCAS) U18.29(_LCAS)
_BRAS_UU: C152C.1 R152C.2 U16.28(_UCAS) U18.28(_UCAS)
_BWE: R152G.2 U16.13(_WE) U17.13(_WE) U18.13(_WE) U19.13(_WE)
_CAS: U20.24(CAS_) ; also sheet 7
_DBR: U20.34(DBR_) ; also sheet 7
_DS: U20.13(DS_) ; also sheet 2,6
_DWE: U20.31(WE_)
_LDS: R164.2
_OEB: U20.101(OEB_)
_RAS: U20.28(RAS_) ; also sheet 7
_ROE: R161.2 U16.27(_OE) U17.27(_OE) U18.27(_OE) U19.27(_OE)
_RST: U20.93(RESET_) ; also sheet 2,6,7,12
_UDS: R163.2
A0: U20.15(A(0)) ; also sheet 2
A1: U20.14(A(1)) ; also sheet 2,7
BDRA0: R151AH.16 U16.16(A0) U17.16(A0) U18.16(A0) U19.16(A0)
BDRA1: R151AH.15 U16.17(A1) U17.17(A1) U18.17(A1) U19.17(A1)
BDRA2: R151AH.14 U16.18(A2) U17.18(A2) U18.18(A2) U19.18(A2)
BDRA3: R151AH.13 U16.19(A3) U17.19(A3) U18.19(A3) U19.19(A3)
BDRA4: R151AH.12 U16.22(A4) U17.22(A4) U18.22(A4) U19.22(A4)
BDRA5: R151AH.11 U16.23(A5) U17.23(A5) U18.23(A5) U19.23(A5)
BDRA6: R151AH.10 U16.24(A6) U17.24(A6) U18.24(A6) U19.24(A6)
BDRA7: R151AH.9 U16.25(A7) U17.25(A7) U18.25(A7) U19.25(A7)
BDRA8: R151I.2 U16.26(A8) U17.26(A8) U18.26(A8) U19.26(A8)
D0: U20.9(D0) ; also sheet 2,11
D1: U20.8(D1) ; also sheet 2,11
D2: U20.7(D2) ; also sheet 2,11
D3: U20.6(D3) ; also sheet 2,11
D4: U20.5(D4) ; also sheet 2,11
D5: U20.4(D5) ; also sheet 2,11
D6: U20.3(D6) ; also sheet 2,11
D7: U20.2(D7) ; also sheet 2,11
D8: U20.127(D8) ; also sheet 2,11
D9: U20.126(D9) ; also sheet 2,11
D10: U20.125(D10) ; also sheet 2,11
D11: U20.124(D11) ; also sheet 2,11
D12: U20.123(D12) ; also sheet 2,11
D13: U20.122(D13) ; also sheet 2,11
D14: U20.121(D14) ; also sheet 2,11
D15: U20.120(D15) ; also sheet 2,11
D16: U20.118(D16) ; also sheet 2,11
D17: U20.117(D17) ; also sheet 2,11
D18: U20.116(D18) ; also sheet 2,11
D19: U20.115(D19) ; also sheet 2,11
D20: U20.114(D20) ; also sheet 2,11
D21: U20.113(D21) ; also sheet 2,11
D22: U20.112(D22) ; also sheet 2,11
D23: U20.111(D23) ; also sheet 2,11
D24: U20.110(D24) ; also sheet 2,11
D25: U20.109(D25) ; also sheet 2,11
D26: U20.108(D26) ; also sheet 2,11
D27: U20.106(D27) ; also sheet 2,11
D28: U20.105(D28) ; also sheet 2,11
D29: U20.104(D29) ; also sheet 2,11
D30: U20.103(D30) ; also sheet 2,11
D31: U20.102(D31) ; also sheet 2,11
DRA0: R151AH.1 U20.29(DRA0) ; also sheet 7
DRA1: R151AH.2 ; also sheet 7
DRA2: R151AH.3 ; also sheet 7
DRA3: R151AH.4 ; also sheet 7
DRA4: R151AH.5 ; also sheet 7
DRA5: R151AH.6 ; also sheet 7
DRA6: R151AH.7 ; also sheet 7
DRA7: R151AH.8 ; also sheet 7
DRA8: R151I.1 ; also sheet 7
DRD0: U17.2(D0) U19.2(D0) U20.37(DRD0) ; also sheet 12,13
DRD1: U17.3(D1) U19.3(D1) U20.38(DRD1) ; also sheet 12,13
DRD2: U17.4(D2) U19.4(D2) U20.39(DRD2) ; also sheet 12,13
DRD3: U17.5(D3) U19.5(D3) U20.40(DRD3) ; also sheet 12,13
DRD4: U17.7(D4) U19.7(D4) U20.41(DRD4) ; also sheet 12,13
DRD5: U17.8(D5) U19.8(D5) U20.42(DRD5) ; also sheet 12,13
DRD6: U17.9(D6) U19.9(D6) U20.43(DRD6) ; also sheet 12,13
DRD7: U17.10(D7) U19.10(D7) U20.44(DRD7) ; also sheet 12,13
DRD8: U17.31(D8) U19.31(D8) U20.46(DRD8) ; also sheet 12,13
DRD9: U17.32(D9) U19.32(D9) U20.47(DRD9) ; also sheet 12,13
DRD10: U17.33(D10) U19.33(D10) U20.48(DRD10) ; also sheet 12,13
DRD11: U17.34(D11) U19.34(D11) U20.49(DRD11) ; also sheet 12,13
DRD12: U17.36(D12) U19.36(D12) U20.50(DRD12) ; also sheet 12,13
DRD13: U17.37(D13) U19.37(D13) U20.51(DRD13) ; also sheet 12,13
DRD14: U17.38(D14) U19.38(D14) U20.52(DRD14) ; also sheet 12,13
DRD15: U17.39(D15) U19.39(D15) U20.53(DRD15) ; also sheet 12,13
DRD16: U16.2(D0) U18.2(D0) U20.55(DRD16) ; also sheet 7,12,13
DRD17: U16.3(D1) U18.3(D1) U20.56(DRD17) ; also sheet 7,12,13
DRD18: U16.4(D2) U18.4(D2) U20.57(DRD18) ; also sheet 7,12,13
DRD19: U16.5(D3) U18.5(D3) U20.58(DRD19) ; also sheet 7,12,13
DRD20: U16.7(D4) U18.7(D4) U20.59(DRD20) ; also sheet 7,12,13
DRD21: U16.8(D5) U18.8(D5) U20.60(DRD21) ; also sheet 7,12,13
DRD22: U16.9(D6) U18.9(D6) U20.61(DRD22) ; also sheet 7,12,13
DRD23: U16.10(D7) U18.10(D7) U20.62(DRD23) ; also sheet 7,12,13
DRD24: U16.31(D8) U18.31(D8) U20.63(DRD24) ; also sheet 7,12,13
DRD25: U16.32(D9) U18.32(D9) U20.64(DRD25) ; also sheet 7,12,13
DRD26: U16.33(D10) U18.33(D10) U20.66(DRD26) ; also sheet 7,12,13
DRD27: U16.34(D11) U18.34(D11) U20.67(DRD27) ; also sheet 7,12,13
DRD28: U16.36(D12) U18.36(D12) U20.68(DRD28) ; also sheet 7,12,13
DRD29: U16.37(D13) U18.37(D13) U20.69(DRD29) ; also sheet 7,12,13
DRD30: U16.38(D14) U18.38(D14) U20.70(DRD30) ; also sheet 7,12,13
DRD31: U16.39(D15) U18.39(D15) U20.71(DRD31) ; also sheet 7,12,13
GND [GND]: C152A.2 C152B.2 C152C.2 C152D.2 C152E.2 C152F.2 R161.1 ; also sheet 2,4,5,7,11,12,13
N$22: R152G.1 U20.30(BWE_)
N$23: R163.1 U20.11(UDS_)
N$24: R164.1 U20.12(LDS_)
N$25: R162.1 U20.19(CAS_XX_)
N$30: R152F.1 U20.20(CAS_LL_)
N$31: R152E.1 U20.21(CAS_LM_)
N$34: R152D.1 U20.22(CAS_UM_)
N$35: R152C.1 U20.23(CAS_UU_)
N$36: R152B.1 U20.27(RAS_0_)
N$37: R152A.1 U20.26(RAS_1_)
R_W: U20.18(R_W) ; also sheet 2,6,7
SIZE_0: U20.17(SIZE_0) ; also sheet 2,6
SIZE_1: U20.16(SIZE_1) ; also sheet 2,6
Unconnected: U16.21(GND0) U17.21(GND0) U18.21(GND0) U19.21(GND0)

### Buses
D:D[0..31]
DRA:DRA[0..10]
A:A[0..31]
DRD:DRD[0..31]

## Sheet 9 of 13: CLOCK
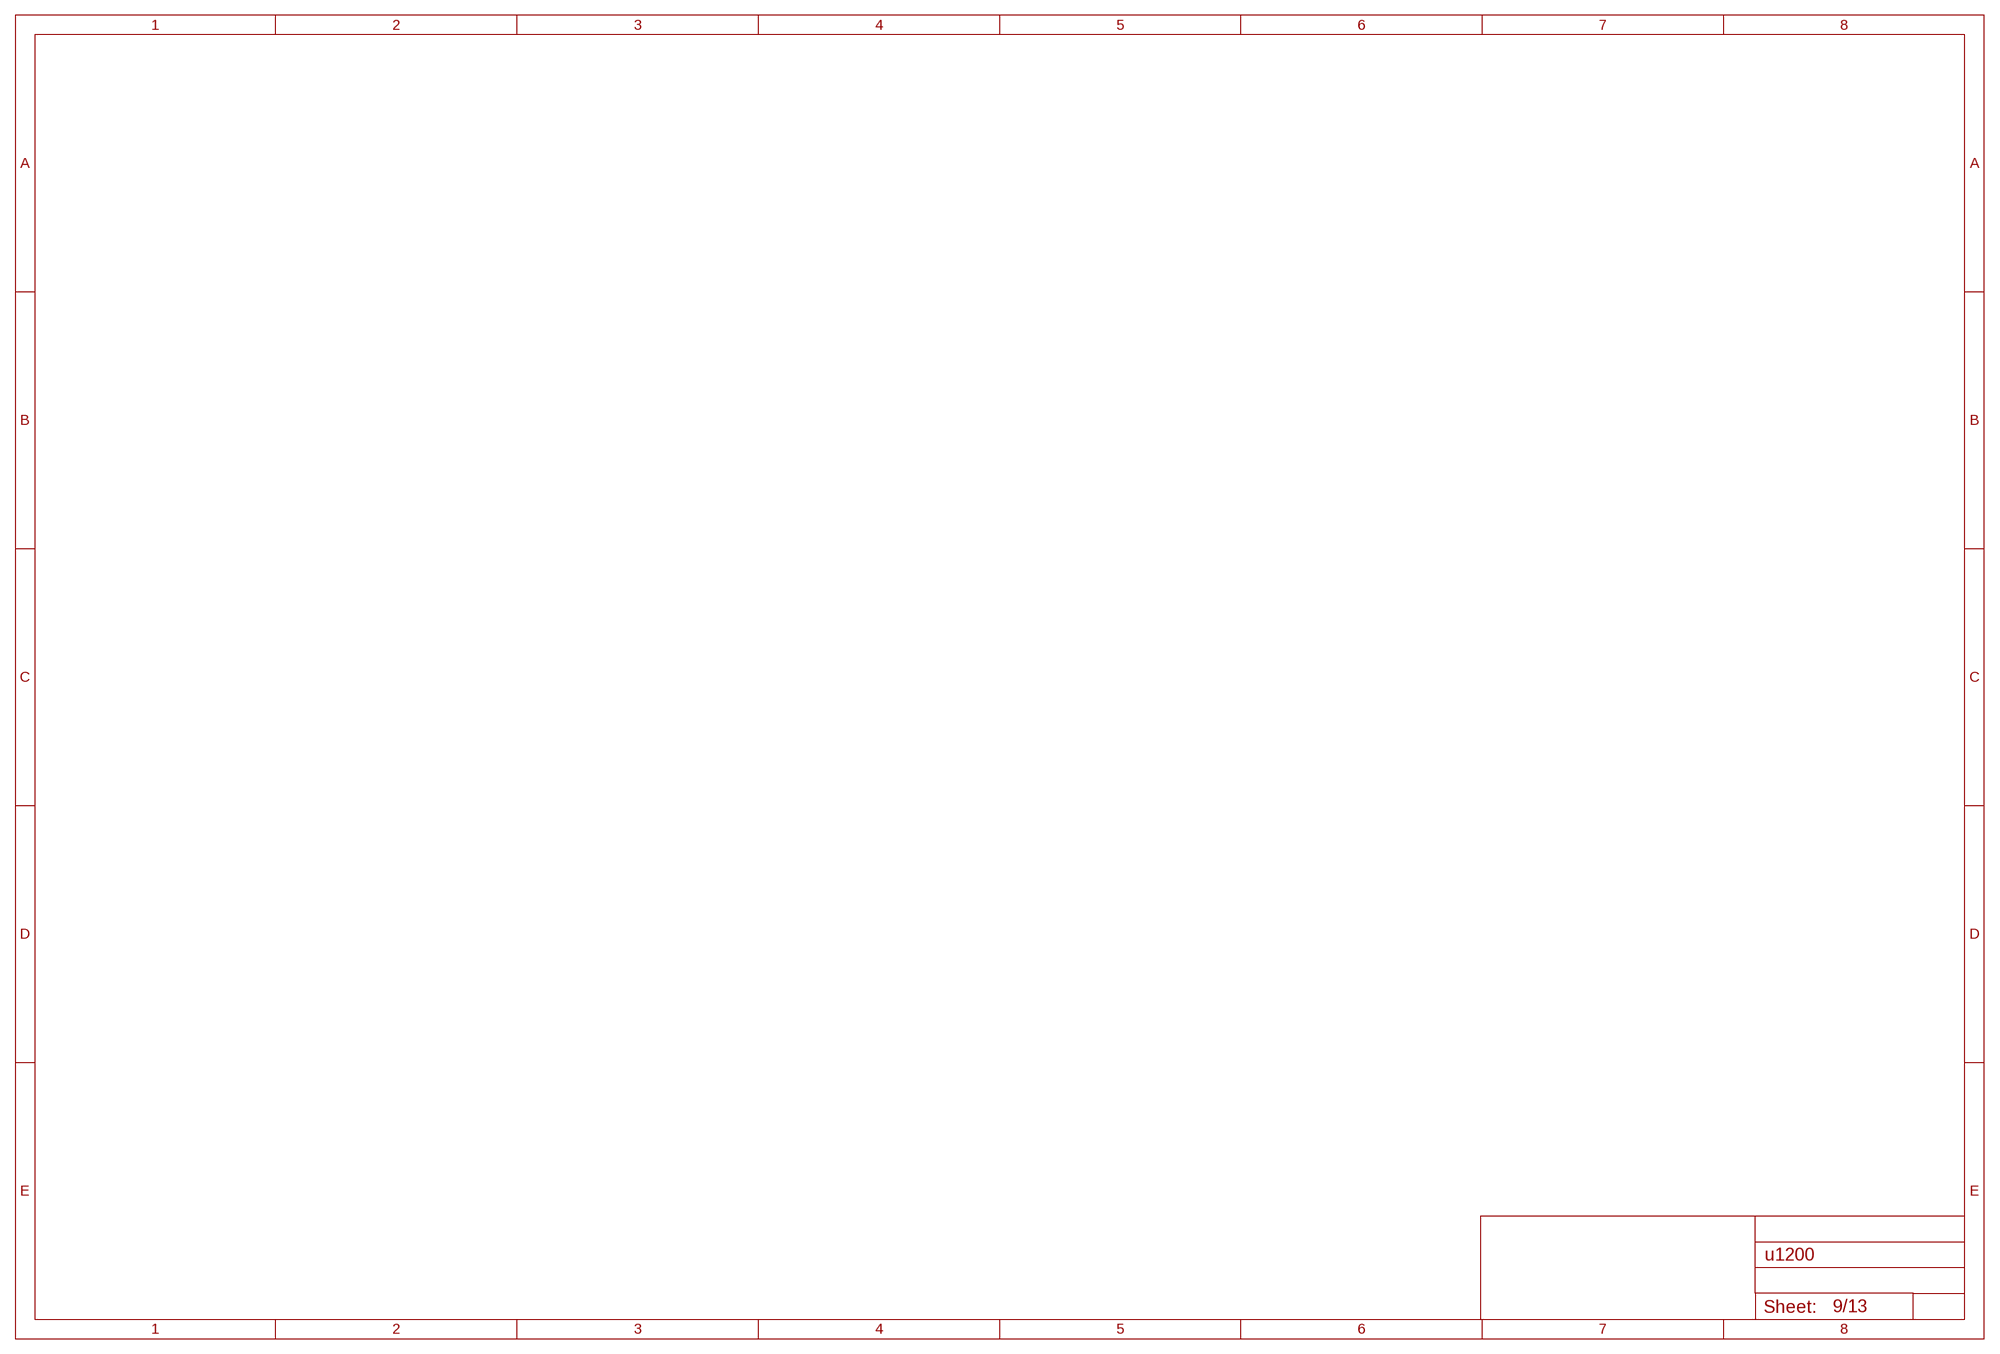
[diagram p8: schematic, sheet 9]

## Sheet 10 of 13: MEMORY CARD
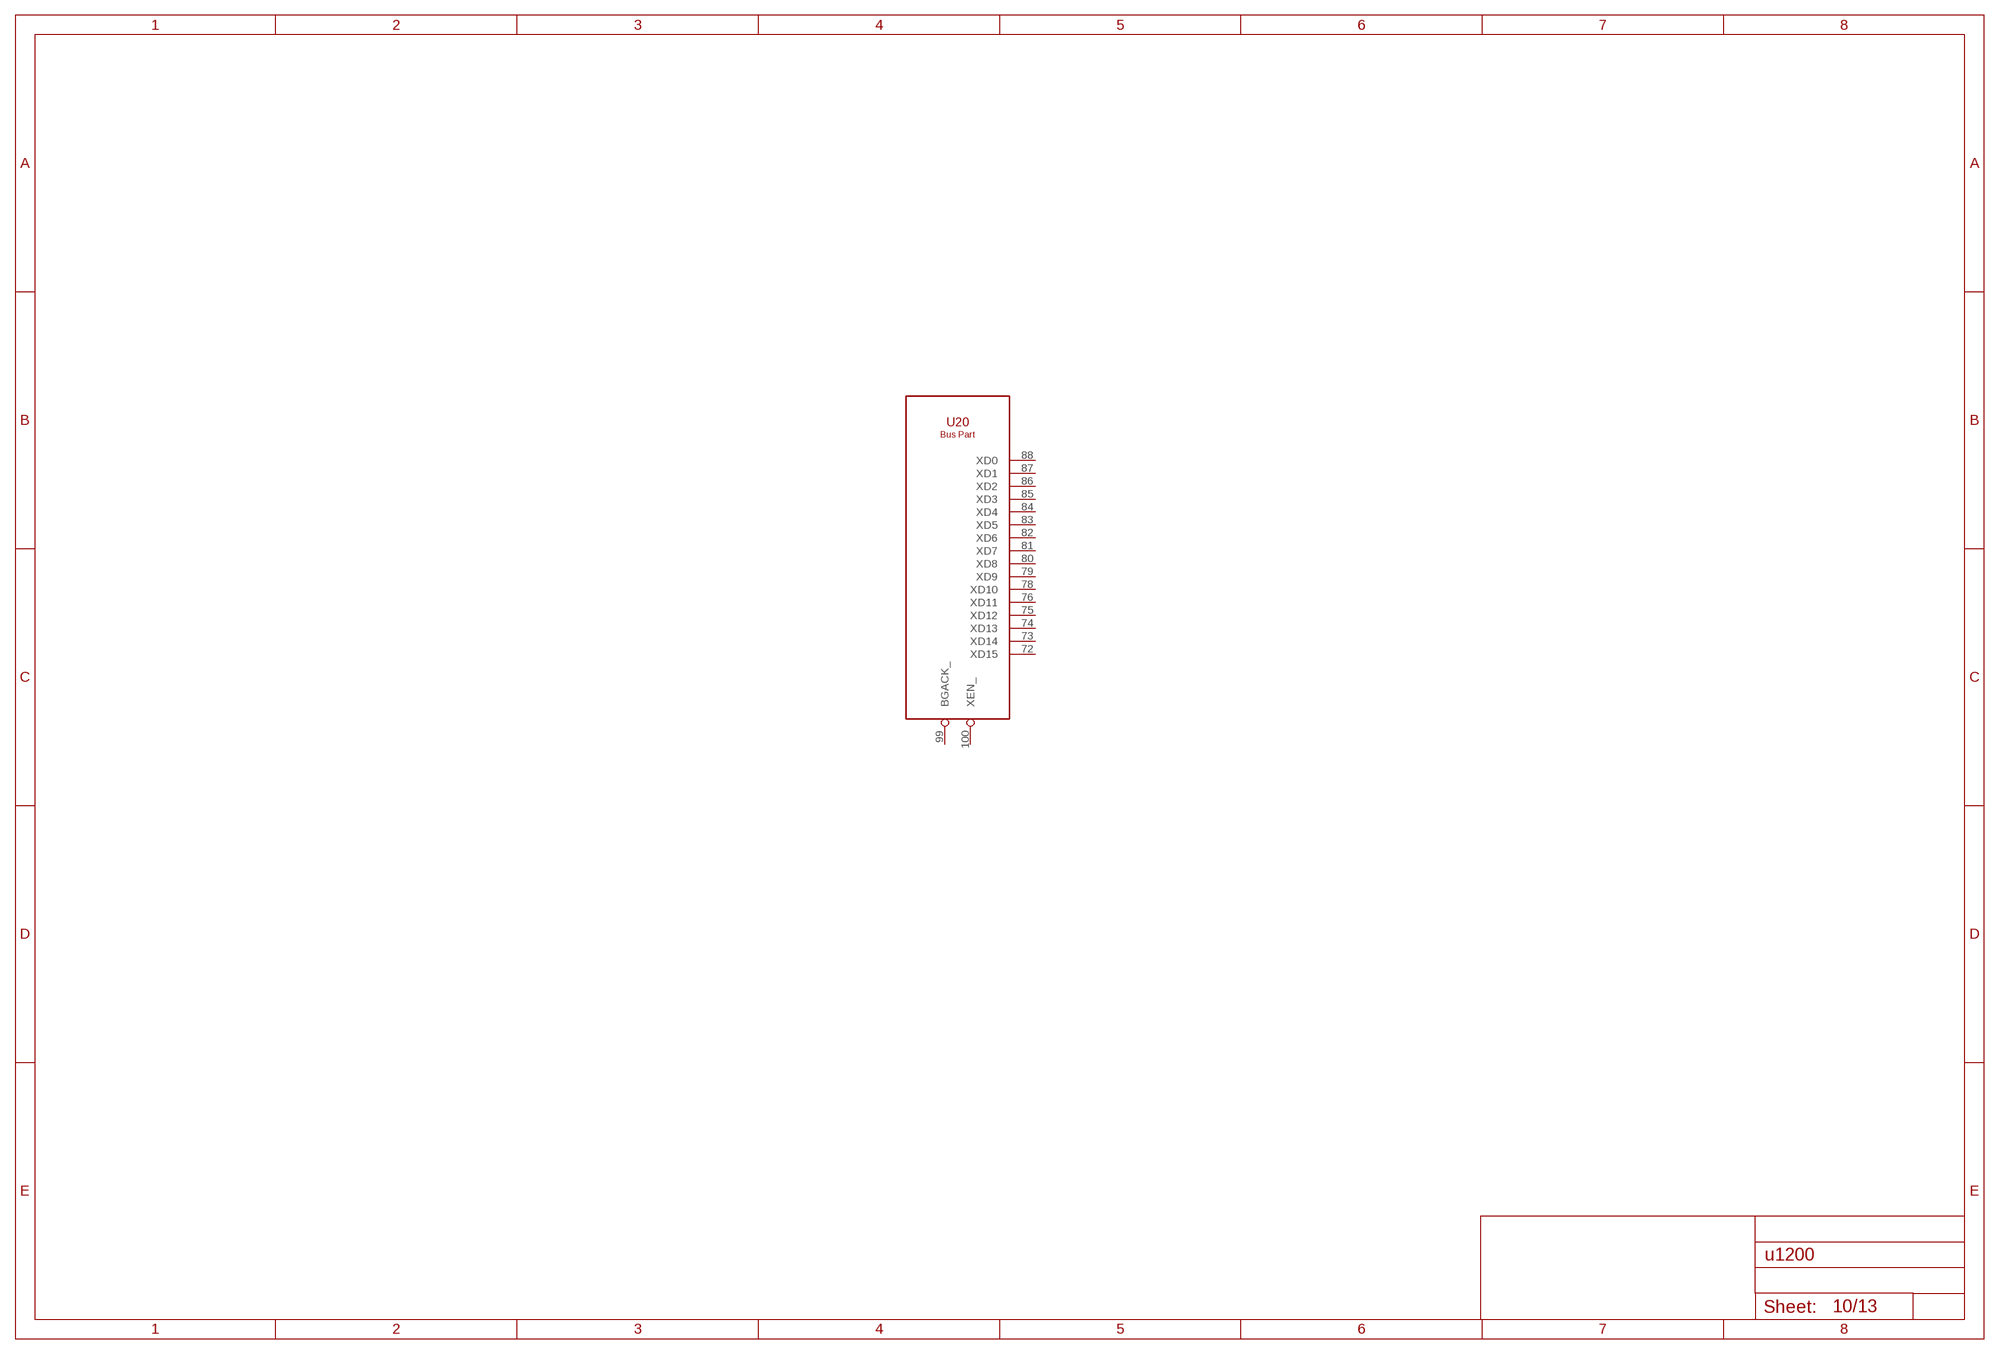
[diagram p9: schematic, sheet 10]
Unconnected: U20.72(XD15) U20.73(XD14) U20.74(XD13) U20.75(XD12) U20.76(XD11) U20.78(XD10) U20.79(XD9) U20.80(XD8) U20.81(XD7) U20.82(XD6) U20.83(XD5) U20.84(XD4) U20.85(XD3) U20.86(XD2) U20.87(XD1) U20.88(XD0) U20.99(BGACK_) U20.100(XEN_)

## Sheet 11 of 13: ROMS
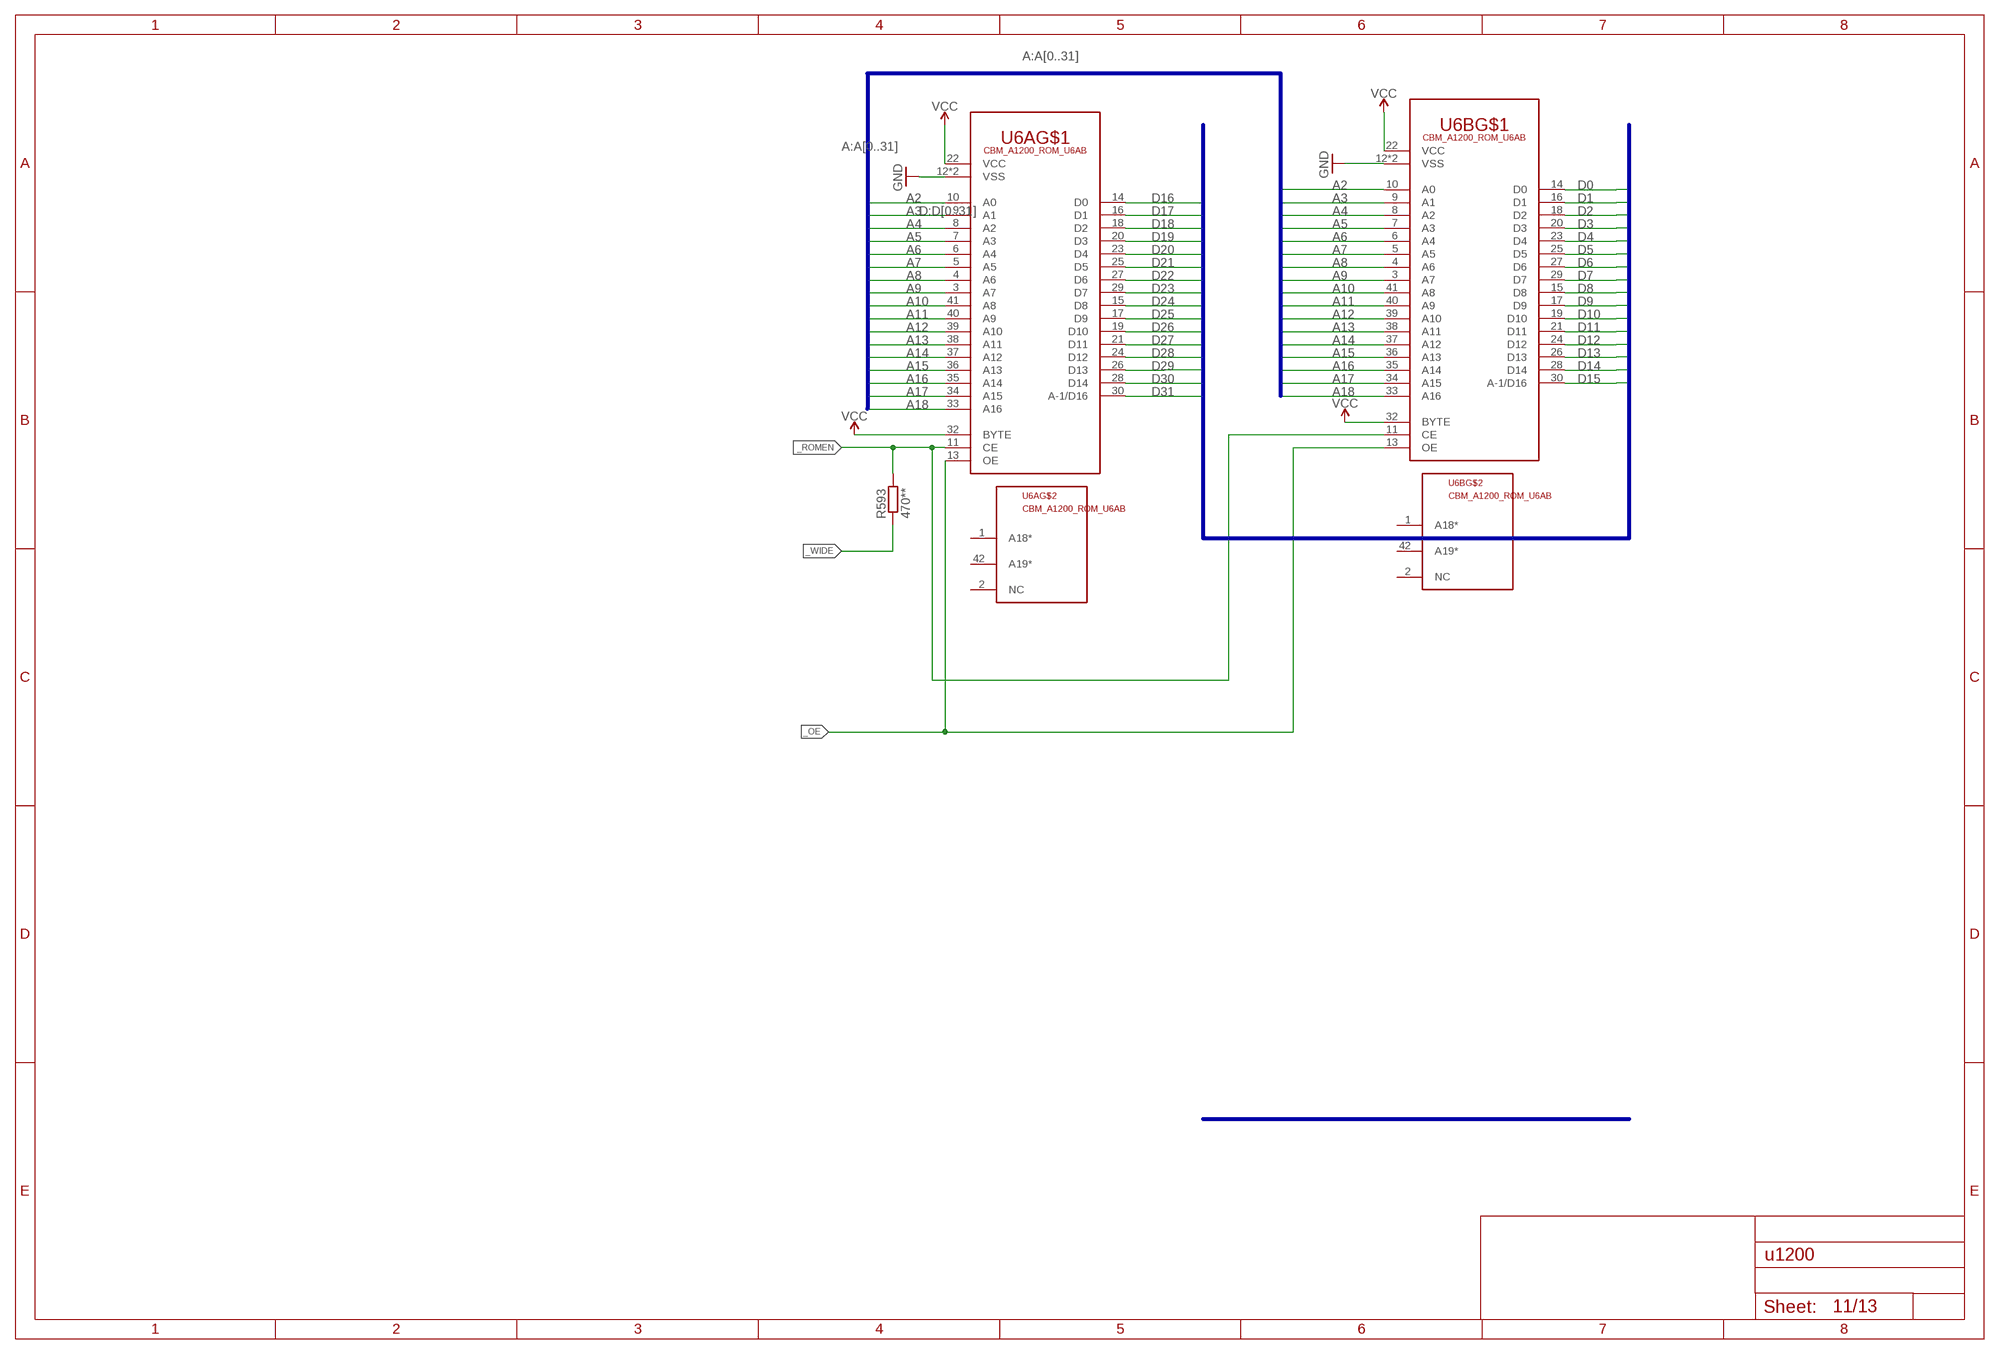
[diagram p10: schematic, sheet 11]

### Parts
R593  470**  R-EU_R0603  [R0603]
U6A  CBM_A1200_ROM_U6AB  [CBM_A1200_ROM_DIL42]
U6B  CBM_A1200_ROM_U6AB  [CBM_A1200_ROM_DIL42]

### Nets
_OE: U6A.13(OE) U6B.13(OE) ; also sheet 2
_ROMEN: R593.2 U6A.11(CE) U6B.11(CE)
_WIDE: R593.1 ; also sheet 2,6
A2: U6A.10(A0) U6B.10(A0) ; also sheet 2,7
A3: U6A.9(A1) U6B.9(A1) ; also sheet 2,7
A4: U6A.8(A2) U6B.8(A2) ; also sheet 2,7
A5: U6A.7(A3) U6B.7(A3) ; also sheet 2,7
A6: U6A.6(A4) U6B.6(A4) ; also sheet 2,7
A7: U6A.5(A5) U6B.5(A5) ; also sheet 2,7
A8: U6A.4(A6) U6B.4(A6) ; also sheet 2,7
A9: U6A.3(A7) U6B.3(A7) ; also sheet 2,7
A10: U6A.41(A8) U6B.41(A8) ; also sheet 2,7
A11: U6A.40(A9) U6B.40(A9) ; also sheet 2,7
A12: U6A.39(A10) U6B.39(A10) ; also sheet 2,7
A13: U6A.38(A11) U6B.38(A11) ; also sheet 2,7
A14: U6A.37(A12) U6B.37(A12) ; also sheet 2,7
A15: U6A.36(A13) U6B.36(A13) ; also sheet 2,7
A16: U6A.35(A14) U6B.35(A14) ; also sheet 2,7
A17: U6A.34(A15) U6B.34(A15) ; also sheet 2,7
A18: U6A.33(A16) U6B.33(A16) ; also sheet 2,7
D0: U6B.14(D0) ; also sheet 2,8
D1: U6B.16(D1) ; also sheet 2,8
D2: U6B.18(D2) ; also sheet 2,8
D3: U6B.20(D3) ; also sheet 2,8
D4: U6B.23(D4) ; also sheet 2,8
D5: U6B.25(D5) ; also sheet 2,8
D6: U6B.27(D6) ; also sheet 2,8
D7: U6B.29(D7) ; also sheet 2,8
D8: U6B.15(D8) ; also sheet 2,8
D9: U6B.17(D9) ; also sheet 2,8
D10: U6B.19(D10) ; also sheet 2,8
D11: U6B.21(D11) ; also sheet 2,8
D12: U6B.24(D12) ; also sheet 2,8
D13: U6B.26(D13) ; also sheet 2,8
D14: U6B.28(D14) ; also sheet 2,8
D15: U6B.30(A-1/D16) ; also sheet 2,8
D16: U6A.14(D0) ; also sheet 2,8
D17: U6A.16(D1) ; also sheet 2,8
D18: U6A.18(D2) ; also sheet 2,8
D19: U6A.20(D3) ; also sheet 2,8
D20: U6A.23(D4) ; also sheet 2,8
D21: U6A.25(D5) ; also sheet 2,8
D22: U6A.27(D6) ; also sheet 2,8
D23: U6A.29(D7) ; also sheet 2,8
D24: U6A.15(D8) ; also sheet 2,8
D25: U6A.17(D9) ; also sheet 2,8
D26: U6A.19(D10) ; also sheet 2,8
D27: U6A.21(D11) ; also sheet 2,8
D28: U6A.24(D12) ; also sheet 2,8
D29: U6A.26(D13) ; also sheet 2,8
D30: U6A.28(D14) ; also sheet 2,8
D31: U6A.30(A-1/D16) ; also sheet 2,8
GND [GND]: U6A.12(VSS) U6A.31(VSS) U6B.12(VSS) U6B.31(VSS) ; also sheet 2,4,5,7,8,12,13
VCC [VCC]: U6A.22(VCC) U6A.32(BYTE) U6B.22(VCC) U6B.32(BYTE) ; also sheet 2,4,6,7,13
Unconnected: U6A.1(A18*) U6A.2(NC) U6A.42(A19*) U6B.1(A18*) U6B.2(NC) U6B.42(A19*)

### Buses
A:A[0..31]
D:D[0..31]

## Sheet 12 of 13: VIDEO
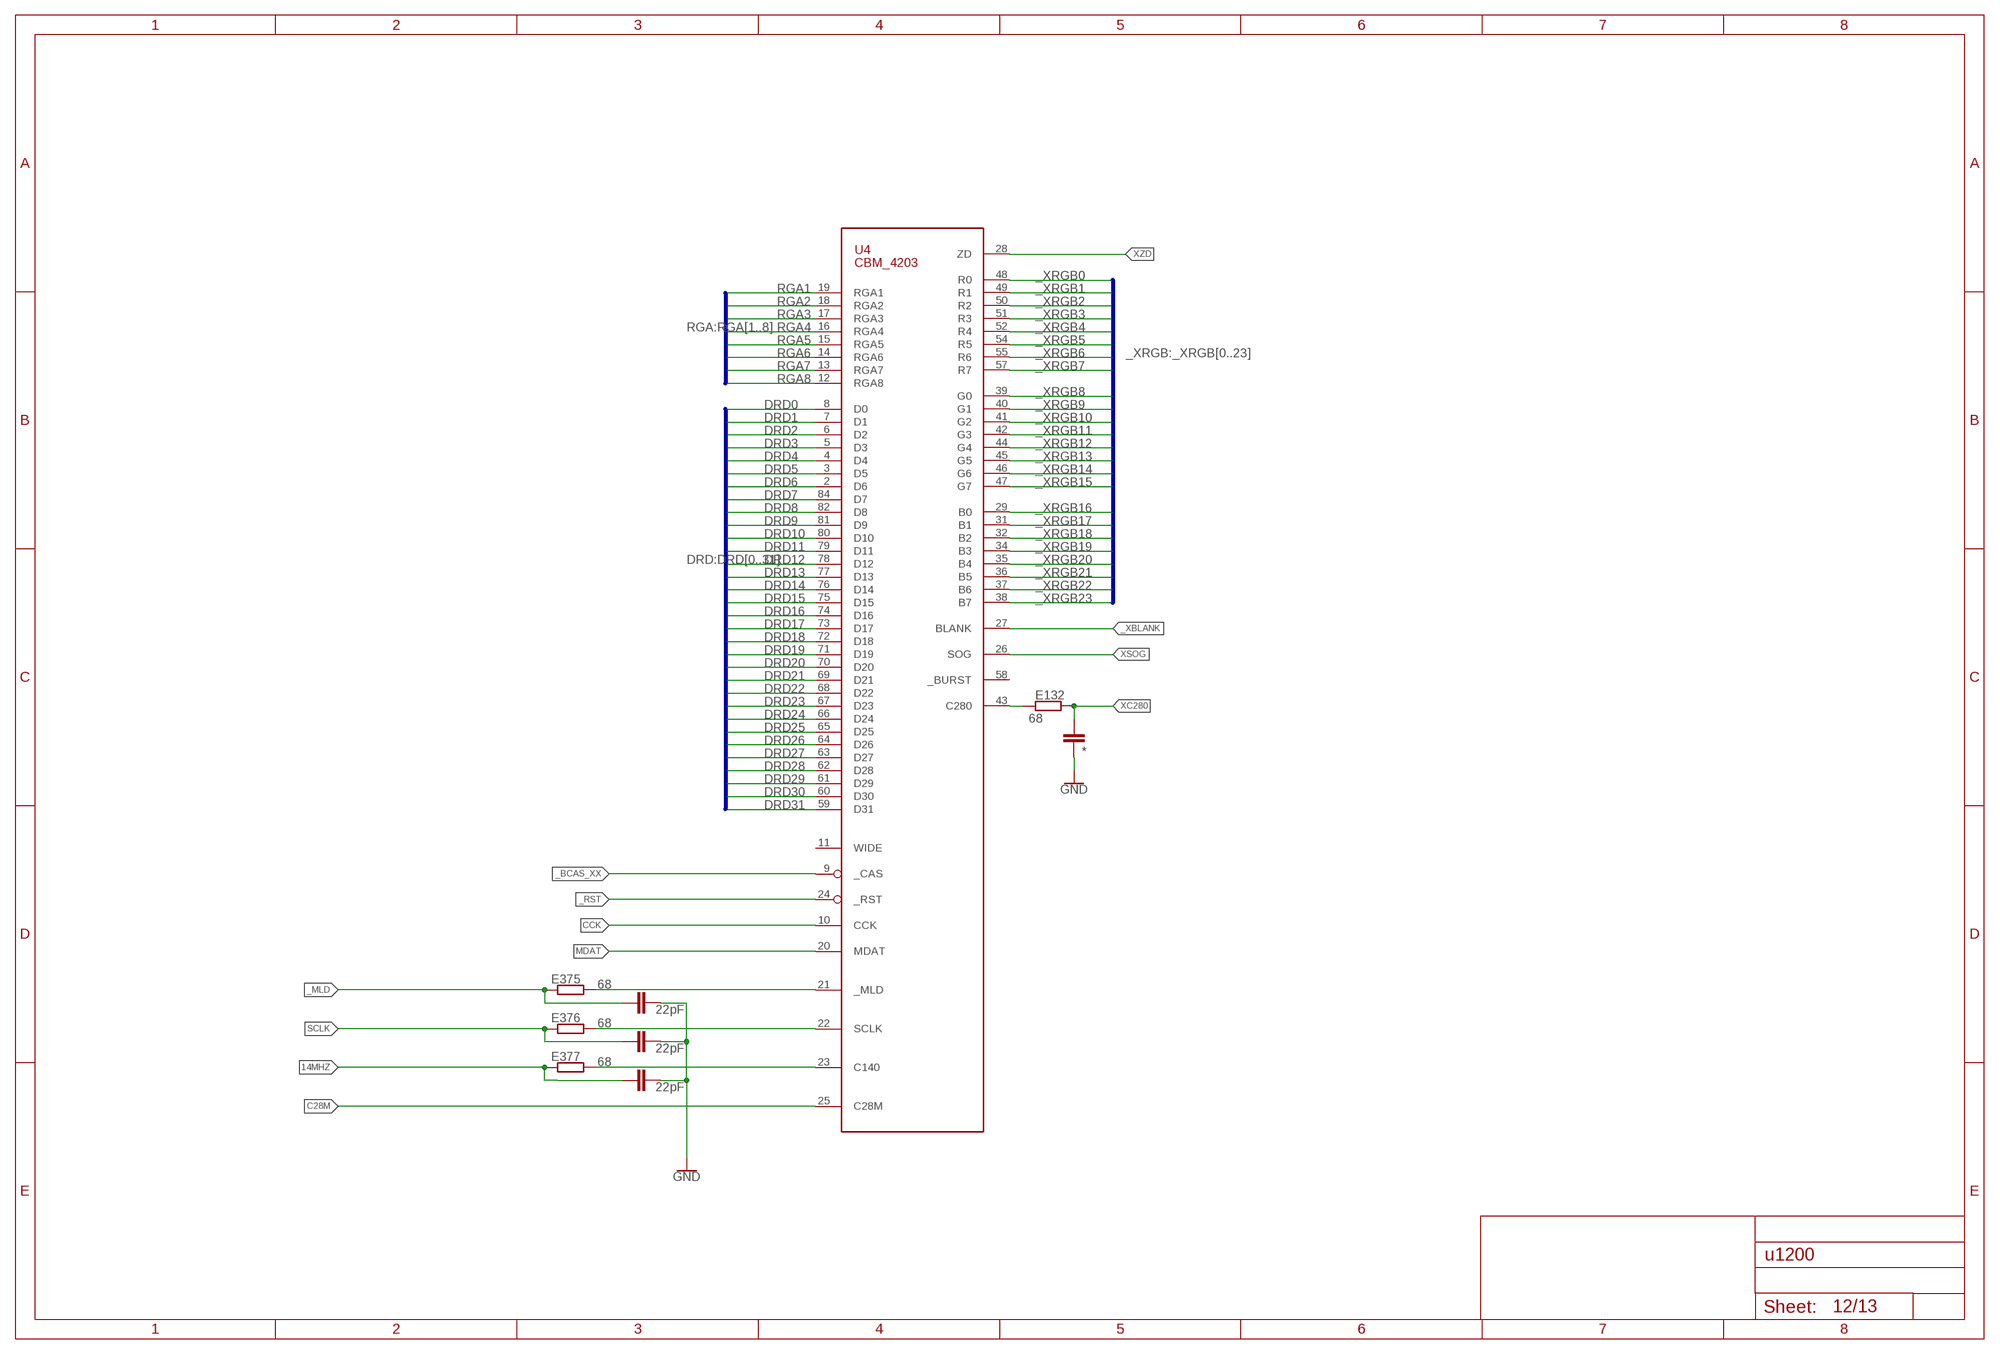
[diagram p11: schematic, sheet 12]

### Parts
E132C  *  C-EUC0805  [C0805]
E132R  68  R-EU_R0805  [R0805]
E375C  22pF  C-EUC0805  [C0805]
E375R  68  R-EU_R0805  [R0805]
E376C  22pF  C-EUC0805  [C0805]
E376R  68  R-EU_R0805  [R0805]
E377C  22pF  C-EUC0805  [C0805]
E377R  68  R-EU_R0805  [R0805]
U4  CBM_4203  [PLCC84-SMD-AMP-SOCKED]

### Nets
14MHZ: E377C.2 E377R.1 E377R.2 U4.23(C140) ; also sheet 7
_BCAS_XX: U4.9(_CAS) ; also sheet 8
_MLD: E375C.2 E375R.1
_RST: U4.24(_RST) ; also sheet 2,6,7,8
_XBLANK: U4.27(BLANK) ; also sheet 13
_XRGB0: U4.48(R0) ; also sheet 13
_XRGB1: U4.49(R1) ; also sheet 13
_XRGB2: U4.50(R2) ; also sheet 13
_XRGB3: U4.51(R3) ; also sheet 13
_XRGB4: U4.52(R4) ; also sheet 13
_XRGB5: U4.54(R5) ; also sheet 13
_XRGB6: U4.55(R6) ; also sheet 13
_XRGB7: U4.57(R7) ; also sheet 13
_XRGB8: U4.39(G0) ; also sheet 13
_XRGB9: U4.40(G1) ; also sheet 13
_XRGB10: U4.41(G2) ; also sheet 13
_XRGB11: U4.42(G3) ; also sheet 13
_XRGB12: U4.44(G4) ; also sheet 13
_XRGB13: U4.45(G5) ; also sheet 13
_XRGB14: U4.46(G6) ; also sheet 13
_XRGB15: U4.47(G7) ; also sheet 13
_XRGB16: U4.29(B0) ; also sheet 13
_XRGB17: U4.31(B1) ; also sheet 13
_XRGB18: U4.32(B2) ; also sheet 13
_XRGB19: U4.34(B3) ; also sheet 13
_XRGB20: U4.35(B4) ; also sheet 13
_XRGB21: U4.36(B5) ; also sheet 13
_XRGB22: U4.37(B6) ; also sheet 13
_XRGB23: U4.38(B7) ; also sheet 13
C28M: U4.25(C28M)
CCK: U4.10(CCK) ; also sheet 7
DRD0: U4.8(D0) ; also sheet 8,13
DRD1: U4.7(D1) ; also sheet 8,13
DRD2: U4.6(D2) ; also sheet 8,13
DRD3: U4.5(D3) ; also sheet 8,13
DRD4: U4.4(D4) ; also sheet 8,13
DRD5: U4.3(D5) ; also sheet 8,13
DRD6: U4.2(D6) ; also sheet 8,13
DRD7: U4.84(D7) ; also sheet 8,13
DRD8: U4.82(D8) ; also sheet 8,13
DRD9: U4.81(D9) ; also sheet 8,13
DRD10: U4.80(D10) ; also sheet 8,13
DRD11: U4.79(D11) ; also sheet 8,13
DRD12: U4.78(D12) ; also sheet 8,13
DRD13: U4.77(D13) ; also sheet 8,13
DRD14: U4.76(D14) ; also sheet 8,13
DRD15: U4.75(D15) ; also sheet 8,13
DRD16: U4.74(D16) ; also sheet 7,8,13
DRD17: U4.73(D17) ; also sheet 7,8,13
DRD18: U4.72(D18) ; also sheet 7,8,13
DRD19: U4.71(D19) ; also sheet 7,8,13
DRD20: U4.70(D20) ; also sheet 7,8,13
DRD21: U4.69(D21) ; also sheet 7,8,13
DRD22: U4.68(D22) ; also sheet 7,8,13
DRD23: U4.67(D23) ; also sheet 7,8,13
DRD24: U4.66(D24) ; also sheet 7,8,13
DRD25: U4.65(D25) ; also sheet 7,8,13
DRD26: U4.64(D26) ; also sheet 7,8,13
DRD27: U4.63(D27) ; also sheet 7,8,13
DRD28: U4.62(D28) ; also sheet 7,8,13
DRD29: U4.61(D29) ; also sheet 7,8,13
DRD30: U4.60(D30) ; also sheet 7,8,13
DRD31: U4.59(D31) ; also sheet 7,8,13
GND [GND]: E132C.2 E375C.1 E376C.1 E377C.1 ; also sheet 2,4,5,7,8,11,13
MDAT: U4.20(MDAT)
N$9: E375R.2 U4.21(_MLD)
N$10: E132R.1 U4.43(C280)
N$13: E376R.2 U4.22(SCLK)
RGA1: U4.19(RGA1) ; also sheet 7,13
RGA2: U4.18(RGA2) ; also sheet 7,13
RGA3: U4.17(RGA3) ; also sheet 7,13
RGA4: U4.16(RGA4) ; also sheet 7,13
RGA5: U4.15(RGA5) ; also sheet 7,13
RGA6: U4.14(RGA6) ; also sheet 7,13
RGA7: U4.13(RGA7) ; also sheet 7,13
RGA8: U4.12(RGA8) ; also sheet 7,13
SCLK: E376C.2 E376R.1 ; also sheet 7
XC280: E132C.1 E132R.2 ; also sheet 13
XSOG: U4.26(SOG) ; also sheet 13
XZD: U4.28(ZD) ; also sheet 13
Unconnected: U4.1(VSS0) U4.11(WIDE) U4.30(VDD0) U4.33(VSS1) U4.53(VSS2) U4.56(VDD1) U4.58(_BURST) U4.83(VDD2)

### Buses
RGA:RGA[1..8]
DRD:DRD[0..31]
_XRGB:_XRGB[0..23]

### Notes on the sheet
- E132
- E375
- E376
- E377

## Sheet 13 of 13: CHIP_BUS_CONNECTOR
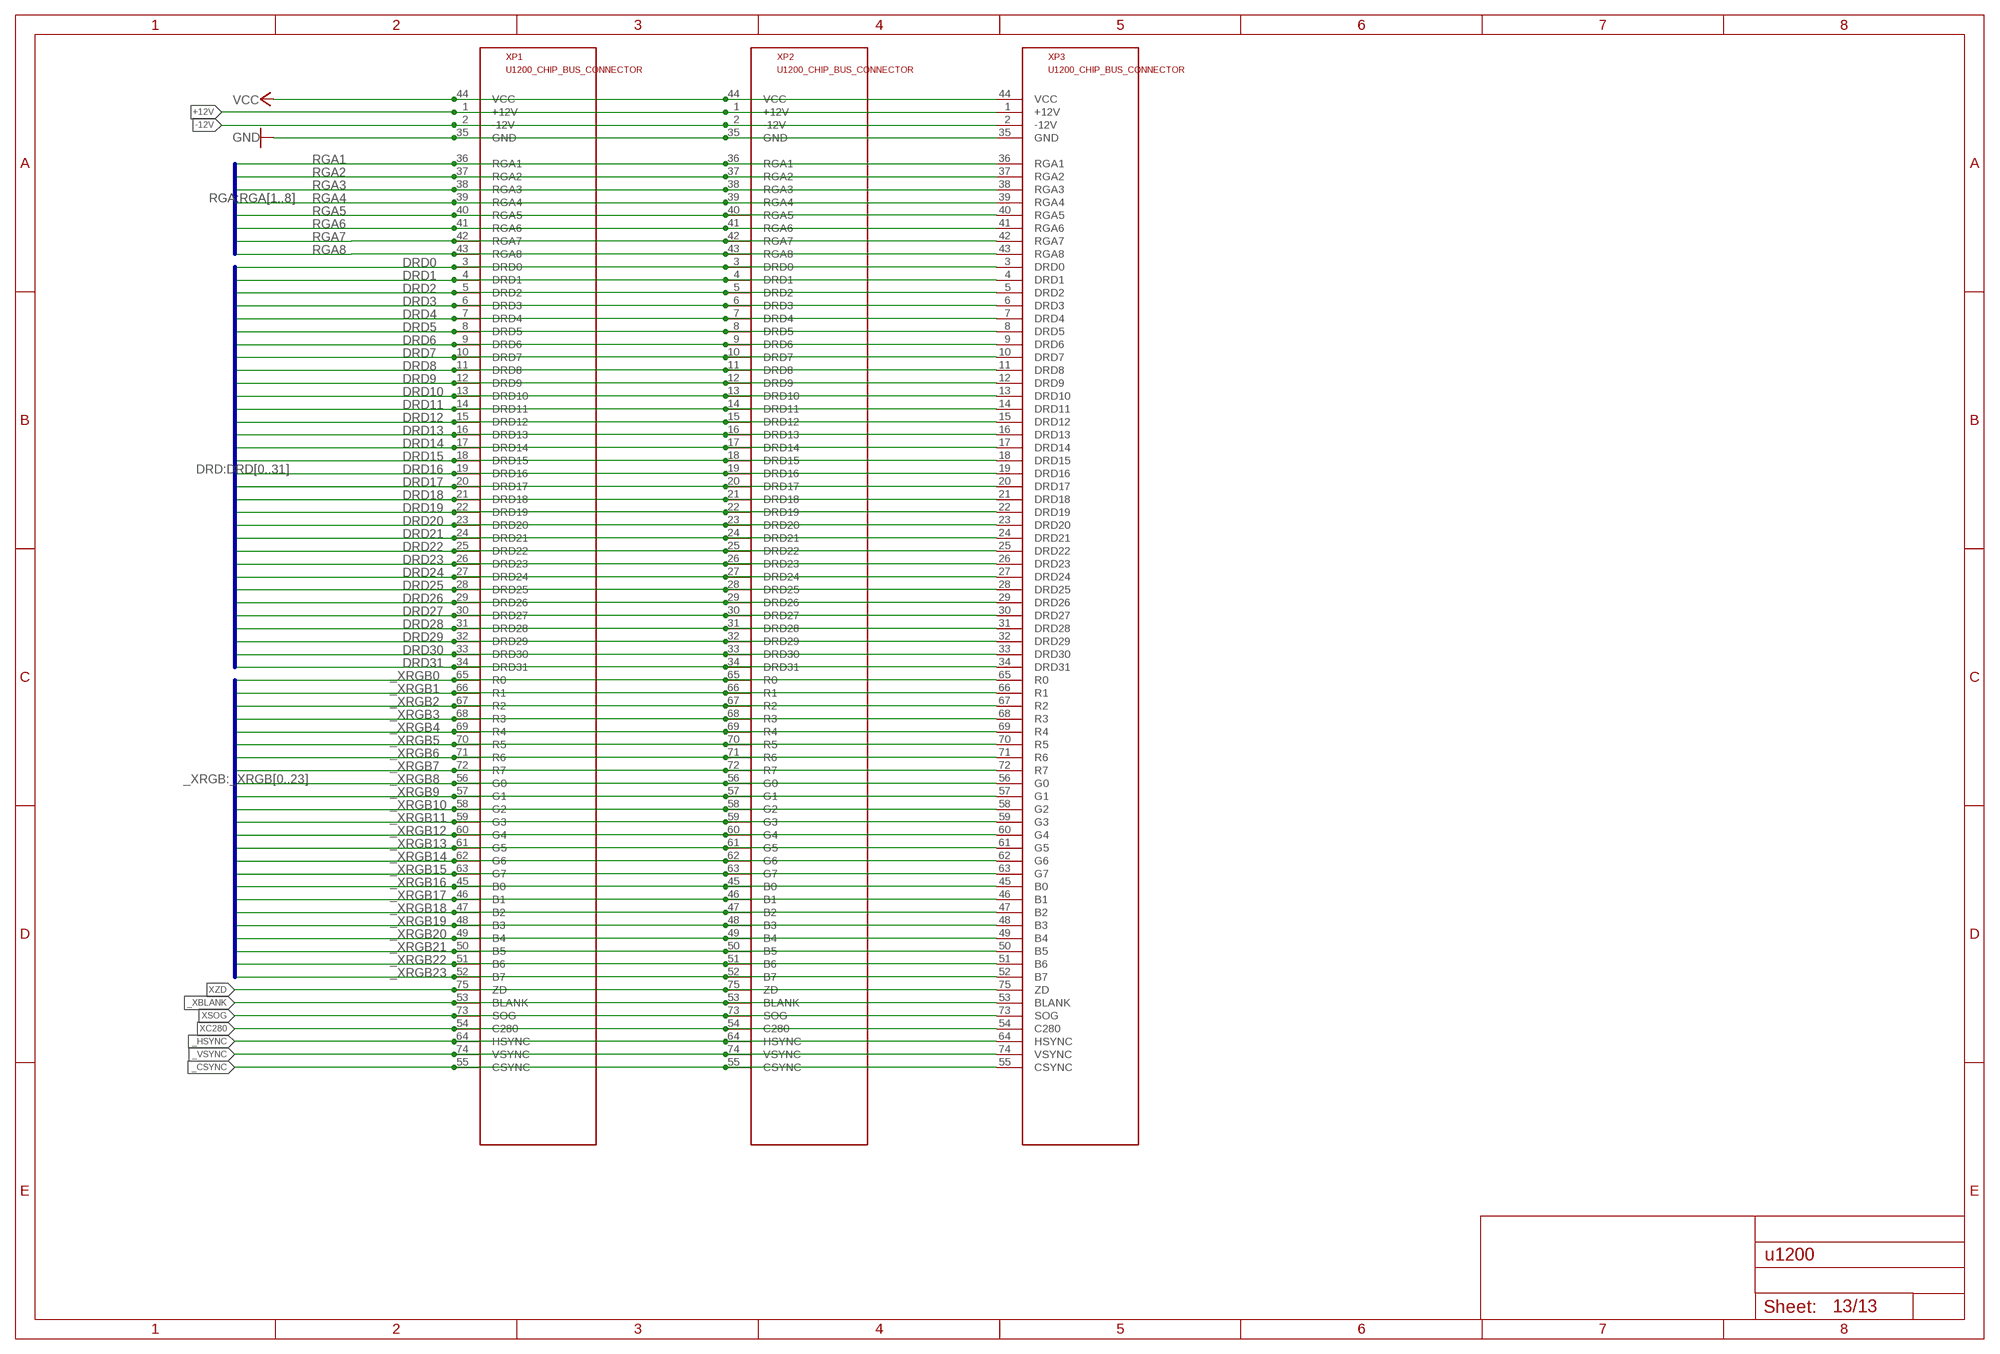
[diagram p12: schematic, sheet 13]

### Parts
XP1  U1200_CHIP_BUS_CONNECTOR  [145167-2]
XP2  U1200_CHIP_BUS_CONNECTOR  [145167-2]
XP3  U1200_CHIP_BUS_CONNECTOR  [145167-2]

### Nets
+12V [+12V]: XP1.1(+12V) XP2.1(+12V) XP3.1(+12V) ; also sheet 2,4
-12V [-12V]: XP1.2(-12V) XP2.2(-12V) XP3.2(-12V) ; also sheet 2,4
_CSYNC: XP1.55(CSYNC) XP2.55(CSYNC) XP3.55(CSYNC) ; also sheet 7
_HSYNC: XP1.64(HSYNC) XP2.64(HSYNC) XP3.64(HSYNC) ; also sheet 7
_VSYNC: XP1.74(VSYNC) XP2.74(VSYNC) XP3.74(VSYNC) ; also sheet 7
_XBLANK: XP1.53(BLANK) XP2.53(BLANK) XP3.53(BLANK) ; also sheet 12
_XRGB0: XP1.65(R0) XP2.65(R0) XP3.65(R0) ; also sheet 12
_XRGB1: XP1.66(R1) XP2.66(R1) XP3.66(R1) ; also sheet 12
_XRGB2: XP1.67(R2) XP2.67(R2) XP3.67(R2) ; also sheet 12
_XRGB3: XP1.68(R3) XP2.68(R3) XP3.68(R3) ; also sheet 12
_XRGB4: XP1.69(R4) XP2.69(R4) XP3.69(R4) ; also sheet 12
_XRGB5: XP1.70(R5) XP2.70(R5) XP3.70(R5) ; also sheet 12
_XRGB6: XP1.71(R6) XP2.71(R6) XP3.71(R6) ; also sheet 12
_XRGB7: XP1.72(R7) XP2.72(R7) XP3.72(R7) ; also sheet 12
_XRGB8: XP1.56(G0) XP2.56(G0) XP3.56(G0) ; also sheet 12
_XRGB9: XP1.57(G1) XP2.57(G1) XP3.57(G1) ; also sheet 12
_XRGB10: XP1.58(G2) XP2.58(G2) XP3.58(G2) ; also sheet 12
_XRGB11: XP1.59(G3) XP2.59(G3) XP3.59(G3) ; also sheet 12
_XRGB12: XP1.60(G4) XP2.60(G4) XP3.60(G4) ; also sheet 12
_XRGB13: XP1.61(G5) XP2.61(G5) XP3.61(G5) ; also sheet 12
_XRGB14: XP1.62(G6) XP2.62(G6) XP3.62(G6) ; also sheet 12
_XRGB15: XP1.63(G7) XP2.63(G7) XP3.63(G7) ; also sheet 12
_XRGB16: XP1.45(B0) XP2.45(B0) XP3.45(B0) ; also sheet 12
_XRGB17: XP1.46(B1) XP2.46(B1) XP3.46(B1) ; also sheet 12
_XRGB18: XP1.47(B2) XP2.47(B2) XP3.47(B2) ; also sheet 12
_XRGB19: XP1.48(B3) XP2.48(B3) XP3.48(B3) ; also sheet 12
_XRGB20: XP1.49(B4) XP2.49(B4) XP3.49(B4) ; also sheet 12
_XRGB21: XP1.50(B5) XP2.50(B5) XP3.50(B5) ; also sheet 12
_XRGB22: XP1.51(B6) XP2.51(B6) XP3.51(B6) ; also sheet 12
_XRGB23: XP1.52(B7) XP2.52(B7) XP3.52(B7) ; also sheet 12
DRD0: XP1.3(DRD0) XP2.3(DRD0) XP3.3(DRD0) ; also sheet 8,12
DRD1: XP1.4(DRD1) XP2.4(DRD1) XP3.4(DRD1) ; also sheet 8,12
DRD2: XP1.5(DRD2) XP2.5(DRD2) XP3.5(DRD2) ; also sheet 8,12
DRD3: XP1.6(DRD3) XP2.6(DRD3) XP3.6(DRD3) ; also sheet 8,12
DRD4: XP1.7(DRD4) XP2.7(DRD4) XP3.7(DRD4) ; also sheet 8,12
DRD5: XP1.8(DRD5) XP2.8(DRD5) XP3.8(DRD5) ; also sheet 8,12
DRD6: XP1.9(DRD6) XP2.9(DRD6) XP3.9(DRD6) ; also sheet 8,12
DRD7: XP1.10(DRD7) XP2.10(DRD7) XP3.10(DRD7) ; also sheet 8,12
DRD8: XP1.11(DRD8) XP2.11(DRD8) XP3.11(DRD8) ; also sheet 8,12
DRD9: XP1.12(DRD9) XP2.12(DRD9) XP3.12(DRD9) ; also sheet 8,12
DRD10: XP1.13(DRD10) XP2.13(DRD10) XP3.13(DRD10) ; also sheet 8,12
DRD11: XP1.14(DRD11) XP2.14(DRD11) XP3.14(DRD11) ; also sheet 8,12
DRD12: XP1.15(DRD12) XP2.15(DRD12) XP3.15(DRD12) ; also sheet 8,12
DRD13: XP1.16(DRD13) XP2.16(DRD13) XP3.16(DRD13) ; also sheet 8,12
DRD14: XP1.17(DRD14) XP2.17(DRD14) XP3.17(DRD14) ; also sheet 8,12
DRD15: XP1.18(DRD15) XP2.18(DRD15) XP3.18(DRD15) ; also sheet 8,12
DRD16: XP1.19(DRD16) XP2.19(DRD16) XP3.19(DRD16) ; also sheet 7,8,12
DRD17: XP1.20(DRD17) XP2.20(DRD17) XP3.20(DRD17) ; also sheet 7,8,12
DRD18: XP1.21(DRD18) XP2.21(DRD18) XP3.21(DRD18) ; also sheet 7,8,12
DRD19: XP1.22(DRD19) XP2.22(DRD19) XP3.22(DRD19) ; also sheet 7,8,12
DRD20: XP1.23(DRD20) XP2.23(DRD20) XP3.23(DRD20) ; also sheet 7,8,12
DRD21: XP1.24(DRD21) XP2.24(DRD21) XP3.24(DRD21) ; also sheet 7,8,12
DRD22: XP1.25(DRD22) XP2.25(DRD22) XP3.25(DRD22) ; also sheet 7,8,12
DRD23: XP1.26(DRD23) XP2.26(DRD23) XP3.26(DRD23) ; also sheet 7,8,12
DRD24: XP1.27(DRD24) XP2.27(DRD24) XP3.27(DRD24) ; also sheet 7,8,12
DRD25: XP1.28(DRD25) XP2.28(DRD25) XP3.28(DRD25) ; also sheet 7,8,12
DRD26: XP1.29(DRD26) XP2.29(DRD26) XP3.29(DRD26) ; also sheet 7,8,12
DRD27: XP1.30(DRD27) XP2.30(DRD27) XP3.30(DRD27) ; also sheet 7,8,12
DRD28: XP1.31(DRD28) XP2.31(DRD28) XP3.31(DRD28) ; also sheet 7,8,12
DRD29: XP1.32(DRD29) XP2.32(DRD29) XP3.32(DRD29) ; also sheet 7,8,12
DRD30: XP1.33(DRD30) XP2.33(DRD30) XP3.33(DRD30) ; also sheet 7,8,12
DRD31: XP1.34(DRD31) XP2.34(DRD31) XP3.34(DRD31) ; also sheet 7,8,12
GND [GND]: XP1.35(GND) XP2.35(GND) XP3.35(GND) ; also sheet 2,4,5,7,8,11,12
RGA1: XP1.36(RGA1) XP2.36(RGA1) XP3.36(RGA1) ; also sheet 7,12
RGA2: XP1.37(RGA2) XP2.37(RGA2) XP3.37(RGA2) ; also sheet 7,12
RGA3: XP1.38(RGA3) XP2.38(RGA3) XP3.38(RGA3) ; also sheet 7,12
RGA4: XP1.39(RGA4) XP2.39(RGA4) XP3.39(RGA4) ; also sheet 7,12
RGA5: XP1.40(RGA5) XP2.40(RGA5) XP3.40(RGA5) ; also sheet 7,12
RGA6: XP1.41(RGA6) XP2.41(RGA6) XP3.41(RGA6) ; also sheet 7,12
RGA7: XP1.42(RGA7) XP2.42(RGA7) XP3.42(RGA7) ; also sheet 7,12
RGA8: XP1.43(RGA8) XP2.43(RGA8) XP3.43(RGA8) ; also sheet 7,12
VCC [VCC]: XP1.44(VCC) XP2.44(VCC) XP3.44(VCC) ; also sheet 2,4,6,7,11
XC280: XP1.54(C280) XP2.54(C280) XP3.54(C280) ; also sheet 12
XSOG: XP1.73(SOG) XP2.73(SOG) XP3.73(SOG) ; also sheet 12
XZD: XP1.75(ZD) XP2.75(ZD) XP3.75(ZD) ; also sheet 12

### Buses
RGA:RGA[1..8]
DRD:DRD[0..31]
_XRGB:_XRGB[0..23]

## Power pins joined to a net without a drawn wire
GND: X1.7(GND)
GND1: U16.35(GND1) U17.35(GND1) U18.35(GND1) U19.35(GND1)
GND2: U16.40(GND2) U17.40(GND2) U18.40(GND2) U19.40(GND2)
VBB: U2.55(VBB)
VCC: X1.14(VCC)
VCC0: U16.1(VCC0) U17.1(VCC0) U18.1(VCC0) U19.1(VCC0)
VCC1: U2.15(VCC1) U16.6(VCC1) U17.6(VCC1) U18.6(VCC1) U19.6(VCC1)
VCC2: U2.52(VCC2) U16.20(VCC2) U17.20(VCC2) U18.20(VCC2) U19.20(VCC2)

## Library data of the parts
C152A C152B C152C C152D C152E C152F C901 C902 E121C E122C E123C E124C E125C E126C E127C E128C E129C E131C E132C E133C E375C E376C E377C = rcl:C-EU: CAPACITOR, European symbol; SPICEPREFIX: C
E121R E122R E123R E124R E125R E126R E127R E128R E129R E131R E132R E133R E375R E376R E377R R100 R102 R104 R151I R152A R152B R152C R152D R152E R152F R152G R161-R164 R592 R593 R901-R903 R953D R953E R953F R954A R954B R954C R954D R954E = rcl:R-EU_: RESISTOR, European symbol; SPICEPREFIX: R
HB HC HF HH HJ HL HR HS = holes:MOUNT-PAD-ROUND: MOUNTING PAD, round
IC1 = 74xx-eu:74*74: Dual D type positive edge triggered FLIP FLOP, preset and clear
J1 = SparkFun-Connectors:ATX24: ATX24 Pin Power Supply Connector - Right Angle PTH Mount This is a good connector for connecting a computer power supply to a PCB. It's massive, but provides many amps of power at 5V and 12V. SparkFun Products: SparkFun Benchtop Power Board Kit <https://www.sparkfun.com/products/12867> SparkFun Power Driver Shield Kit <https://www.sparkfun.com/products/10618>; PROD_ID: CONN-09674; SF_ID: PRT-09498
JP1 = u1200:U1200_JP_CASE
LED_FDD = SparkFun-LED:LED-YELLOW: Yellow SMD LED Used in manufacturing several products at SparkFun. Packages: 0603 - SMD 0603 package[Product Link] <http://www.kingbrightusa.com/product.asp?catalog_name=LED&product_id=APT1608SYCK> 0603 -SMART - SMART SMD 0603 package (more efficient/more expensive) [Product Link] <http://www.osram-os.com/osram_os/en/products/product-catalog/led-light-emitting-diodes/smartled-0603/ly-l29k/index.jsp> LilyPad - SMD1206 package[Product Datasheet] <https://www.sparkfun.com/datasheets/DevTools/LilyPad/Q150YUS4.pdf> SparkFun Products: Blynk Board <https://www.sparkfun.com/products/13794> IOIO-OTG <https://www.sparkfun.com/products/13613> XBee Explorer Serial <https://www.sparkfun.com/products/13225>; PROD_ID: DIO-09003
LED_HDD = SparkFun-LED:LED-RED: Red SMD LED Used in manufacturing of most products at SparkFun Packages: 0603 - SMD 0603 package [Product Link] <http://docs.avagotech.com/docs/AV02-0551EN> 0603 SMART - SMD 0603 SMART package ( more efficient and expensive)[Product Link] <http://www.osram-os.com/Graphics/XPic2/00077099_0.pdf> 1206 - SMD1206 package [Product Link] <https://www.sparkfun.com/datasheets/DevTools/LilyPad/Q150OVS4.pdff> SparkFun Products: Pro Mini 328 -5V <https://www.sparkfun.com/products/821> RedBoard <https://www.sparkfun.com/products/12757> IOIO-OTG <https://www.sparkfun.com/products/13613>; PROD_ID: DIO-00819
LED_PWR = SparkFun-LED:LED-GREEN: Green SMD LED Used in manufacturing of various products at SparkFun Packages: 0603 - SMD 0603 package [Product Link] <http://www.futureelectronics.com/en/technologies/semiconductors/optoelectronics/leds/Pages/9894312-LTST-C190GKT.aspx?CrossPart=HSMG-C190&IM=0> LilyPad 1206 - SMD1206 LilyPad package [Product Link] <http://www.futureelectronics.com/en/Technologies/Product.aspx?ProductID=IN150NGHARVATEKCORPORATION2049943&IM=0> 1206 - SMD1206 package [Product Link] <http://www.futureelectronics.com/en/technologies/semiconductors/optoelectronics/leds/Pages/8315665-LTST-C150KGKT.aspx?IM=0> 1206 Bottom Mount -SMD 1206 Bottom Mount [Product Link] <http://www.digikey.com/product-detail/en/lite-on-inc/LTST-C230KGKT/160-1456-1-ND/386854> SparkFun Products: Pro Mini 328 -5V <https://www.sparkfun.com/products/821> RedBoard <https://www.sparkfun.com/products/12757> MP3 Trigger <https://www.sparkfun.com/products/13720> Makey Makey <https://www.sparkfun.com/products/11076>; PROD_ID: DIO-00821
P1 = u1200:CBM_A1200_EDGE_CONNECTOR: CBM A1200 Edge "Trapdoor" Connector
PWR_SW RST_SW = SparkFun-Switches:MOMENTARY-SWITCH-SPST-2: Momentary Switch (Pushbutton) - SPST - Two Circuits Normally-open (NO) SPST momentary switches (buttons, pushbuttons). Schematic symbol includes two switch circuits. Variants SMD-4.6MMX2.8MM - 4.60mm x 2.80mm Tactile Momentary Button Switch - Used on SparkFun SAMD21 Mini Breakout <https://www.sparkfun.com/products/13664> SMD-5.2MM - Mini Pushbutton Switch - SMD <https://www.sparkfun.com/products/8720> - Used on Arduino Pro Mini <https://www.sparkfun.com/products/11114>; PROD_ID: SWCH-13065
R101_104_952AB = Resistor Array:741X163220JP: RES ARRAY 8 RES 22 OHM 1506 Manufacturer's datasheet <https://www.ctscorp.com/wp-content/uploads/74x.pdf>; CREATED_BY: PCBLayout.com; DIGIKEY_PARTNO: 741X163471JPTR-ND; MANUFACTURER: CTS Resistor Products; MPN: 741X163471JP; PACKAGE: 1506
R151AH = Resistor Array:742C163220JP: RES ARRAY 8 RES 22 OHM 2506 Manufacturer's datasheet <https://www.ctscorp.com/wp-content/uploads/74x.pdf>; CREATED_BY: PCBLayout.com; DIGIKEY_PARTNO: 742C043680JPTR-ND; MANUFACTURER: CTS Resistor Products; MPN: 742C043680JP; PACKAGE: 2506
R951AG = Resistor Array:741X163220JP: RES ARRAY 8 RES 22 OHM 1506 Manufacturer's datasheet <https://www.ctscorp.com/wp-content/uploads/74x.pdf>; CREATED_BY: PCBLayout.com; DIGIKEY_PARTNO: 746X101472JPTR-ND; MANUFACTURER: CTS Resistor Products; MPN: 746X101472JP; PACKAGE: 1506
U2 = u1200:CBM_8374
U4 = u1200:CBM_4203: CBM 4203 "Lisa"
U6A U6B = u1200:CBM_A1200_ROM_U6AB
U16-U19 = u1200:DRAM_256KX16: Any 256k x 16 DRAM in a 40Pin SOJ Format e.g. V53C16258H
U20 = u1200:CBM_391425
X1 = crystal:XO-: CRYSTAL; OC_FARNELL: unknown; OC_NEWARK: unknown
XP1-XP3 = u1200:U1200_CHIP_BUS_CONNECTOR

## Net classes
0 default: width 0.254 mm
1 GND: width 0.61 mm
2 VCC: width 0.61 mm
3 +12V: width 0.711 mm
4 -12V: width 0.711 mm
5 GND_AUDIO: width 0.61 mm